# EAGLE design labwiz-board (EAGLE 6.5.0)
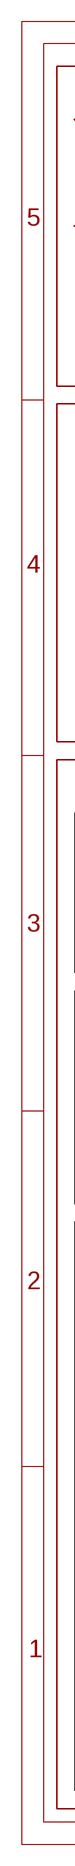
[diagram p0: schematic, sheet 1, part 1 of 2]
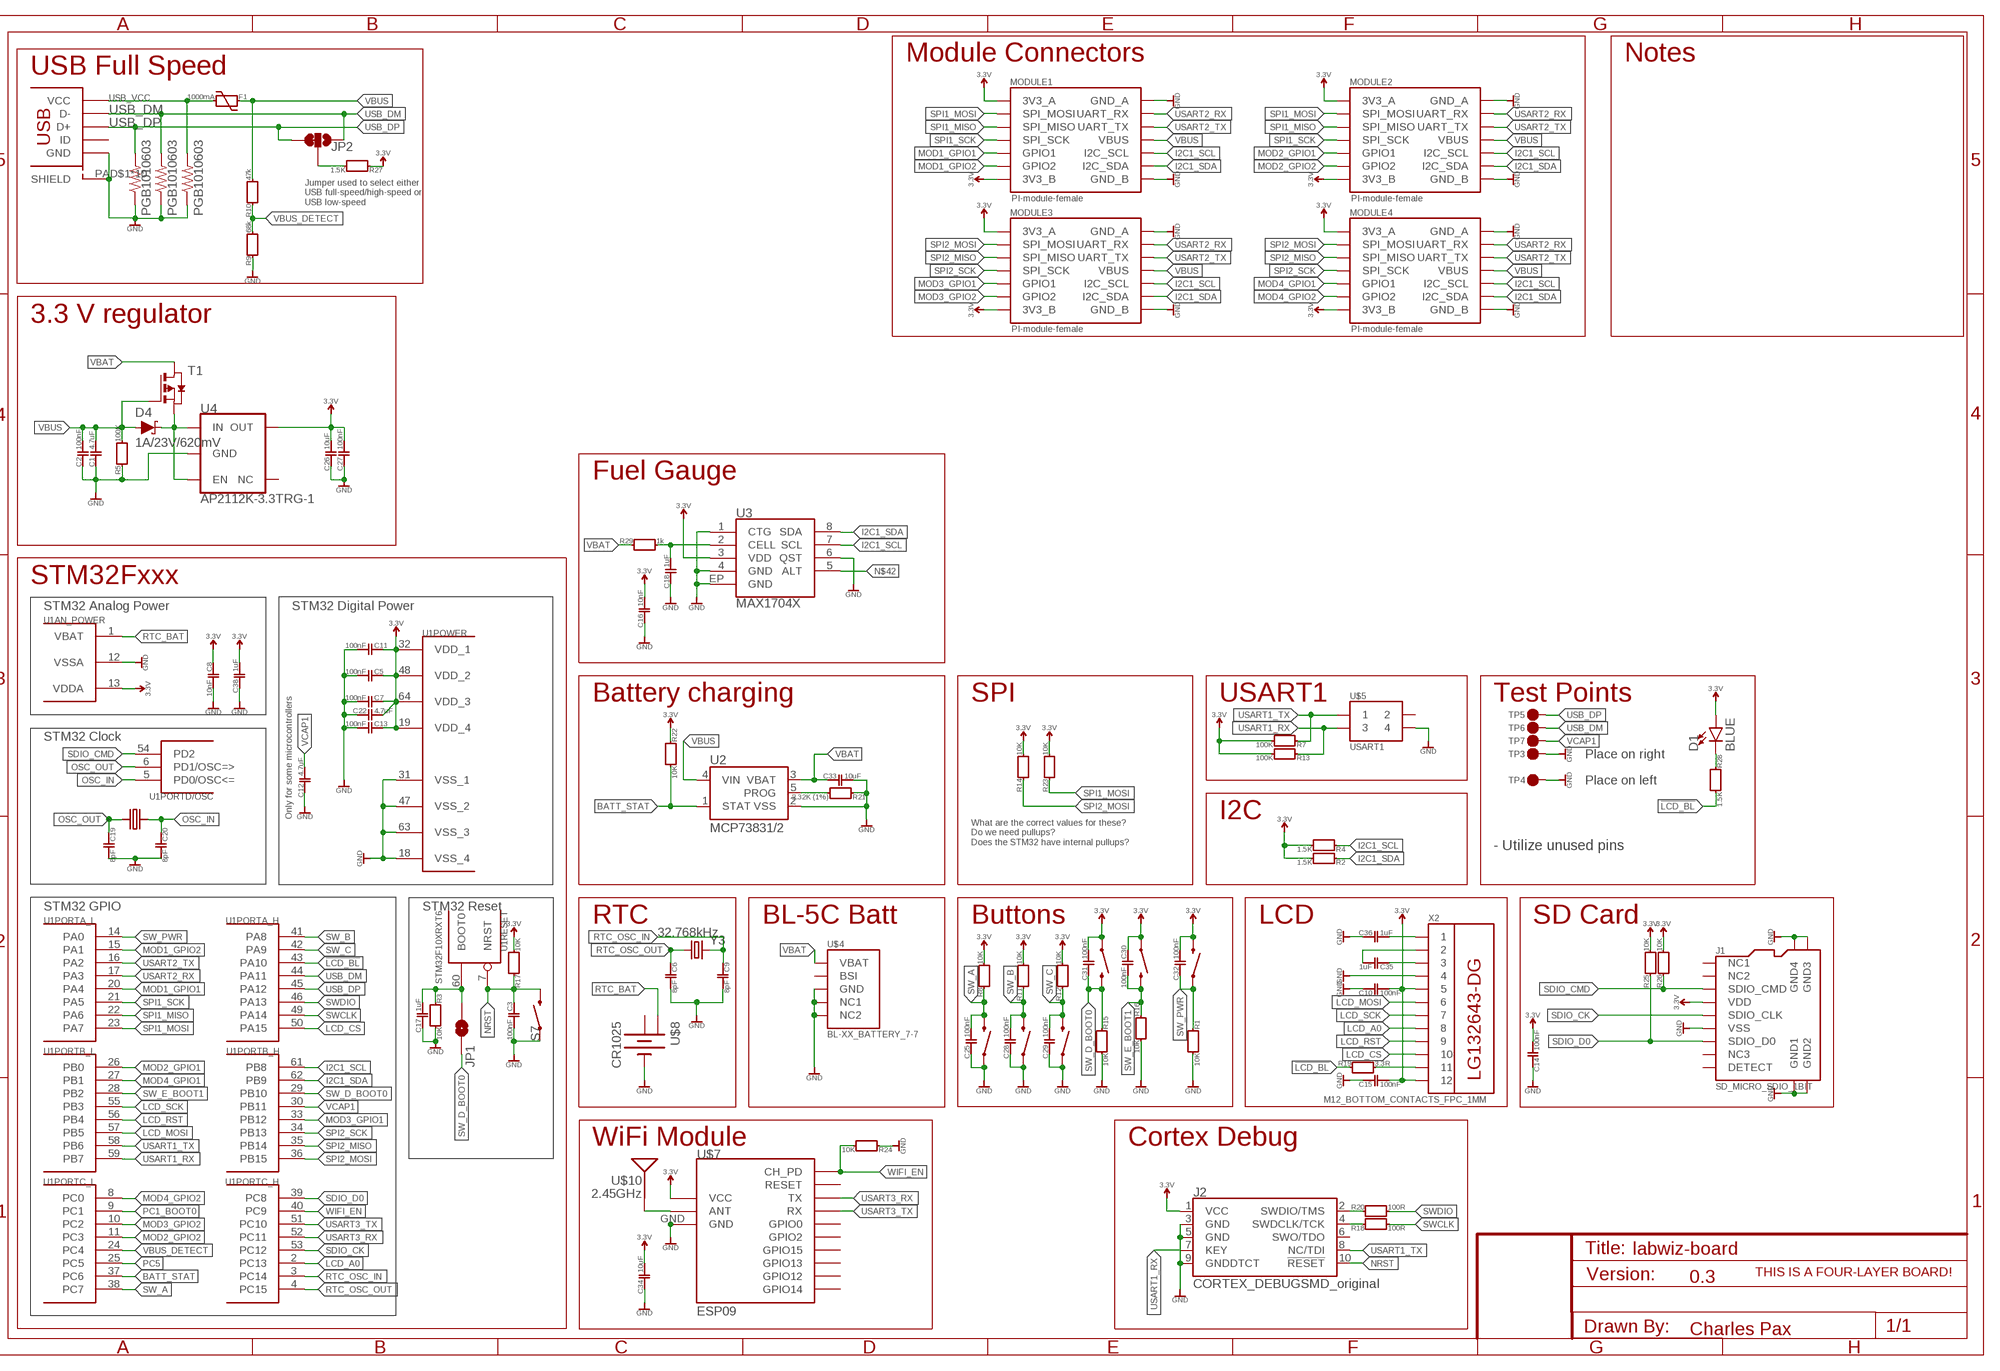
[diagram p1: schematic, sheet 1, part 2 of 2]

## Parts
C1  4.7uF  CAPACITOR_FIXED_4.7UF_0402  [0402]
C2  100nF  CAPACITOR_FIXED_100NF_0402  [0402]
C3  100nF  CAPACITOR_FIXED_100NF_0402  [0402]
C5  100nF  CAPACITOR_FIXED_100NF_0402  [0402]
C6  8pF  CAPACITOR_FIXED_8PF_0402  [0402]
C7  100nF  CAPACITOR_FIXED_100NF_0402  [0402]
C8  10nF  CAPACITOR_FIXED_10NF_0402  [0402]
C9  8pF  CAPACITOR_FIXED_8PF_0402  [0402]
C10  100nF  CAPACITOR_FIXED_100NF_0402  [0402]
C11  100nF  CAPACITOR_FIXED_100NF_0402  [0402]
C12  4.7uF  CAPACITOR_FIXED_4.7UF_0402  [0402]
C13  100nF  CAPACITOR_FIXED_100NF_0402  [0402]
C14  100nF  CAPACITOR_FIXED_100NF_0402  [0402]
C15  100nF  CAPACITOR_FIXED_100NF_0402  [0402]
C16  10nF  CAPACITOR_FIXED_10NF_0402  [0402]
C17  1uF  CAPACITOR_FIXED_1UF_0402  [0402]
C18  1uF  CAPACITOR_FIXED_1UF_0402  [0402]
C19  8pF  CAPACITOR_FIXED_8PF_0402  [0402]
C20  8pF  CAPACITOR_FIXED_8PF_0402  [0402]
C22  4.7uF  CAPACITOR_FIXED_4.7UF_0402  [0402]
C25  100nF  CAPACITOR_FIXED_100NF_0402  [0402]
C26  10uF  CAPACITOR_FIXED_10UF_0402  [0402]
C27  100nF  CAPACITOR_FIXED_100NF_0402  [0402]
C28  100nF  CAPACITOR_FIXED_100NF_0402  [0402]
C29  100nF  CAPACITOR_FIXED_100NF_0402  [0402]
C30  100nF  CAPACITOR_FIXED_100NF_0402  [0402]
C31  100nF  CAPACITOR_FIXED_100NF_0402  [0402]
C32  100nF  CAPACITOR_FIXED_100NF_0402  [0402]
C33  10uF  CAPACITOR_FIXED_10UF_0402  [0402]
C34  10uF  CAPACITOR_FIXED_10UF_0402  [0402]
C35  1uF  CAPACITOR_FIXED_1UF_0402  [0402]
C36  1uF  CAPACITOR_FIXED_1UF_0402  [0402]
C38  1uF  CAPACITOR_FIXED_1UF_0402  [0402]
D1  BLUE  LED-BLUE0603  [LED-0603]
D4  1A/23V/620mV  DIODE-SCHOTTKY-BAT20J  [SOD-323]
F1  1000mA  FUSE_RESETTABLE_PTC_1000MA_0805  [0805]
J1  SD_MICRO_SDIO_1BIT  [SD_MICRO_1]
J2  CORTEX_DEBUGSMD_original  CORTEX_DEBUG_SMD  [SAMTECH_FTSH-105-01]
JP1  DNP  JUMPER-PAD-2-NOYES_SILK  [PAD-JUMPER-2-NO_YES_SILK]
JP2  JUMPER-SMT_3_1-NC_TRACE_SILK  [SMT-JUMPER_3_1-NC_TRACE_SILK]
MODULE1  PI-module-female  PAX_MODULE_EDGE_FEMALE_HOST  [M07X2_2MM_EDGE]
MODULE2  PI-module-female  PAX_MODULE_EDGE_FEMALE_HOST  [M07X2_2MM_EDGE]
MODULE3  PI-module-female  PAX_MODULE_EDGE_FEMALE_HOST  [M07X2_2MM_EDGE]
MODULE4  PI-module-female  PAX_MODULE_EDGE_FEMALE_HOST  [M07X2_2MM_EDGE]
R1  10K  RESISTOR_FIXED_10K_0402  [0402]
R2  1.5K  RESISTOR_FIXED_1.5K_0402  [0402]
R3  10K  RESISTOR_FIXED_10K_0402  [0402]
R4  1.5K  RESISTOR_FIXED_1.5K_0402  [0402]
R5  100K  RESISTOR_FIXED_100K_0402  [0402]
R7  100K  RESISTOR_FIXED_100K_0402  [0402]
R8  10K  RESISTOR_FIXED_10K_0402  [0402]
R9  68k  RESISTOR_FIXED_0402  [0402]
R10  47k  RESISTOR_FIXED_0402  [0402]
R11  10K  RESISTOR_FIXED_10K_0402  [0402]
R12  10K  RESISTOR_FIXED_10K_0402  [0402]
R13  100K  RESISTOR_FIXED_100K_0402  [0402]
R14  10K  RESISTOR_FIXED_10K_0402  [0402]
R15  10K  RESISTOR_FIXED_10K_0402  [0402]
R16  10K  RESISTOR_FIXED_10K_0402  [0402]
R17  10K  RESISTOR_FIXED_10K_0402  [0402]
R18  100R  RESISTOR_FIXED_100R_0402  [0402]
R19  3.3R  RESISTOR_FIXED_3.3R_0402  [0402]
R20  100R  RESISTOR_FIXED_100R_0402  [0402]
R21  2.32K (1%)  RESISTOR_FIXED_2.32K_0402  [0402]
R22  10K  RESISTOR_FIXED_10K_0402  [0402]
R23  10K  RESISTOR_FIXED_10K_0402  [0402]
R24  10K  RESISTOR_FIXED_10K_0402  [0402]
R25  10K  RESISTOR_FIXED_10K_0402  [0402]
R26  10K  RESISTOR_FIXED_10K_0402  [0402]
R27  1.5K  RESISTOR_FIXED_1.5K_0402  [0402]
R28  1.5K  RESISTOR_FIXED_1.5K_0402  [0402]
R29  1k  RESISTOR_FIXED_0402  [0402]
S1  SWITCH-MOMENTARY-2SMD  [TACTILE_SWITCH_SMD]
S2  SWITCH-MOMENTARY-2SMD  [TACTILE_SWITCH_SMD]
S3  SWITCH-MOMENTARY-2SMD  [TACTILE_SWITCH_SMD]
S4  SWITCH-MOMENTARY-2SMD  [TACTILE_SWITCH_SMD]
S5  SWITCH-MOMENTARY-2SMD  [TACTILE_SWITCH_SMD]
S6  SWITCH-MOMENTARY-2SMD  [TACTILE_SWITCH_SMD]
S7  SWITCH-MOMENTARY-2SMD-3  [TACTILE_SWITCH_SMD-3]
T1  PMOSSOT23-6  [SOT23-6]
TP3  DNP  M01_TH  [M01_TH]
TP4  DNP  M01_TH  [M01_TH]
TP5  DNP  M01_PAD_1MM  [PAD_1MM]
TP6  DNP  M01_PAD_1MM  [PAD_1MM]
TP7  DNP  M01_PAD_1MM  [PAD_1MM]
U1  STM32F10XRXT6  [TQFP64]
U2  MCP73831/2  [SOT23-5]
U3  MAX1704X  [TDFN-8]
U4  AP2112K-3.3TRG-1  V_REG_AP2112K-3.3V  [SOT23-5]
U$1  USB_MICROSMT+THRUHULE  [USB_MICRO_THRUHOLE]
U$2  DNP  FOUR_LAYER_WARNING  [FOUR_LAYER_WARNING]
U$3  LG132643-DG  [LG132643-DG]
U$4  BL-XX_BATTERY_7-7  [BL-XX-BATTERY]
U$5  USART1  M02X2_RIGHT_ANGLE  [M02X2_TH_RIGHT_ANGLE]
U$7  ESP09  [ESP09]
U$8  CR1025  [CR2025]
U$9  8MHz  NX3225GD  [NX3225GD]
U$10  2.45GHz  ANTENNA2.4GHZ-6.5X2.2MM  [ANT-2.4GHZ-6.5X2.2MM]
X2  M12_BOTTOM_CONTACTS_FPC_1MM  [FPC_12P_1MM]
Y3  32.768kHz  CRYSTAL3.2X1.5MM  [CRYSTAL-SMD-3.2X1.5MM]
Z1  PGB1010603  SPARKFUN-RESISTORS_RESISTOR0603-RES  [SPARKFUN-RESISTORS_0603-RES]
Z2  PGB1010603  SPARKFUN-RESISTORS_RESISTOR0603-RES  [SPARKFUN-RESISTORS_0603-RES]
Z3  PGB1010603  SPARKFUN-RESISTORS_RESISTOR0603-RES  [SPARKFUN-RESISTORS_0603-RES]

## Nets
3.3V: C5.1 C7.1 C8.1 C10.2 C11.1 C13.1 C14.2 C15.2 C16.2 C22.2 C26.2 C27.2 C30.1 C31.2 C32.2 C34.2 C38.2 D1.A J1.4(VDD) J2.1(VCC) MODULE1.P$1(3V3_A) MODULE1.P$13(3V3_B) MODULE2.P$1(3V3_A) MODULE2.P$13(3V3_B) MODULE3.P$1(3V3_A) MODULE3.P$13(3V3_B) MODULE4.P$1(3V3_A) MODULE4.P$13(3V3_B) R2.1 R4.1 R7.1 R8.1 R11.1 R12.1 R13.1 R14.1 R17.1 R22.2 R23.1 R25.1 R26.1 R27.2 S4.1 S5.1 S6.3 U1.13(AN_POWER:VDDA) U1.19(POWER:VDD_4) U1.32(POWER:VDD_1) U1.48(POWER:VDD_2) U1.64(POWER:VDD_3) U3.3(VDD) U4.5(OUT) U$7.VCC X2.5 X2.12
!LCD_BL: R19.2 R28.1 U1.43(PORTA_H:PA10)
BATT_STAT: R22.1 U1.37(PORTC_L:PC6) U2.1(STAT)
GND [GND]: C1.1 C2.1 C3.2 C5.2 C6.2 C7.2 C8.2 C9.2 C10.1 C11.2 C12.1 C13.2 C14.1 C15.1 C16.1 C17.1 C18.1 C19.2 C20.2 C22.1 C25.1 C26.1 C27.1 C28.1 C29.1 C33.2 C34.1 C36.1 C38.1 J1.6(VSS) J1.G1(GND1) J1.G2(GND2) J1.G3(GND3) J1.G4(GND4) J2.3(GND) J2.5(GND) J2.9(GNDDTCT) MODULE1.P$2(GND_A) MODULE1.P$14(GND_B) MODULE2.P$2(GND_A) MODULE2.P$14(GND_B) MODULE3.P$2(GND_A) MODULE3.P$14(GND_B) MODULE4.P$2(GND_A) MODULE4.P$14(GND_B) R1.1 R3.1 R5.2 R9.2 R15.1 R16.1 R21.2 R24.2 S1.1 S2.1 S3.1 S7.1 TP3.P$1 TP4.P$1 U1.12(AN_POWER:VSSA) U1.18(POWER:VSS_4) U1.31(POWER:VSS_1) U1.47(POWER:VSS_2) U1.63(POWER:VSS_3) U2.2(VSS) U3.1(CTG) U3.4(GND) U3.6(QST) U3.EP(GND) U4.2(GND) U$1.PAD$1(SHIELD) U$1.PAD$2(SHIELD) U$1.PAD$3(SHIELD) U$1.PAD$4(SHIELD) U$1.PAD$5(SHIELD) U$1.PAD$6(SHIELD) U$1.PAD$7(SHIELD) U$1.PAD$8(SHIELD) U$1.PAD$9(SHIELD) U$1.PAD$10(SHIELD) U$1.PIN$5(GND) U$4.P$3(GND) U$4.P$4(NC1) U$4.P$5(NC2) U$5.4 U$7.GND U$7.GND1 U$7.GND2 U$7.GND3 U$7.GND4 U$7.GND5 U$7.GND6 U$7.GND7 U$8.P$1(-) X2.4 Z1.1 Z2.1 Z3.1
I2C1_SCL: MODULE1.P$10(I2C_SCL) MODULE2.P$10(I2C_SCL) MODULE3.P$10(I2C_SCL) MODULE4.P$10(I2C_SCL) R4.2 U1.61(PORTB_H:PB8) U3.7(SCL)
I2C1_SDA [3.3V power]: MODULE1.P$12(I2C_SDA) MODULE2.P$12(I2C_SDA) MODULE3.P$12(I2C_SDA) MODULE4.P$12(I2C_SDA) R2.2 U1.62(PORTB_H:PB9) U3.8(SDA)
LCD_A0: U1.2(PORTC_H:PC13) X2.8
LCD_CS: U1.50(PORTA_H:PA15) X2.10
LCD_MOSI: U1.57(PORTB_L:PB5) X2.6
LCD_RST: U1.56(PORTB_L:PB4) X2.9
LCD_SCK: U1.55(PORTB_L:PB3) X2.7
MOD1_GPIO1: MODULE1.P$9(GPIO1) U1.20(PORTA_L:PA4)
MOD1_GPIO2: MODULE1.P$11(GPIO2) U1.15(PORTA_L:PA1)
MOD2_GPIO1: MODULE2.P$9(GPIO1) U1.26(PORTB_L:PB0)
MOD2_GPIO2: MODULE2.P$11(GPIO2) U1.11(PORTC_L:PC3)
MOD3_GPIO1: MODULE3.P$9(GPIO1) U1.33(PORTB_H:PB12)
MOD3_GPIO2: MODULE3.P$11(GPIO2) U1.10(PORTC_L:PC2)
MOD4_GPIO1: MODULE4.P$9(GPIO1) U1.27(PORTB_L:PB1)
MOD4_GPIO2: MODULE4.P$11(GPIO2) U1.8(PORTC_L:PC0)
N$4: R19.1 X2.11
N$5: JP2.2 R27.1
N$13: U$7.ANT U$10.FEED(SIGNAL)
N$16: C18.2 R29.1 U3.2(CELL)
N$25: D1.C R28.2
N$26 [3.3V power]: D4.C T1.4(S) U4.1(IN) U4.3(EN)
N$37: C35.1 X2.3
N$38: C35.2 X2.2
N$39: C36.2 X2.1
N$42: U3.5(ALT)
N$70: R21.1 U2.5(PROG)
NRST: C3.1 J2.10(!RESET) R17.2 S7.4 U1.7(RESET:NRST)
OSC_IN: C20.1 U1.5(PORTD/OSC:PD0/OSC<=) U$9.P$2
OSC_OUT: C19.1 U1.6(PORTD/OSC:PD1/OSC=>) U$9.P$1
PC1_BOOT0: C17.2 JP1.2 R3.2 U1.9(PORTC_L:PC1) U1.60(RESET:BOOT0)
PC5: U1.25(PORTC_L:PC5)
RTC_BAT [RTC battery]: U1.1(AN_POWER:VBAT) U$8.P$3(+1)
RTC_OSC_IN: C9.1 U1.3(PORTC_H:PC14) Y3.P$2
RTC_OSC_OUT: C6.1 U1.4(PORTC_H:PC15) Y3.P$1
SDIO_CK: J1.5(SDIO_CLK) U1.53(PORTC_H:PC12)
SDIO_CMD: J1.3(SDIO_CMD) R26.2 U1.54(PORTD/OSC:PD2)
SDIO_D0: J1.7(SDIO_D0) R25.2 U1.39(PORTC_H:PC8)
SPI1_MISO: MODULE1.P$5(SPI_MISO) MODULE2.P$5(SPI_MISO) U1.22(PORTA_L:PA6)
SPI1_MOSI: MODULE1.P$3(SPI_MOSI) MODULE2.P$3(SPI_MOSI) R23.2 U1.23(PORTA_L:PA7)
SPI1_SCK: MODULE1.P$7(SPI_SCK) MODULE2.P$7(SPI_SCK) U1.21(PORTA_L:PA5)
SPI2_MISO: MODULE3.P$5(SPI_MISO) MODULE4.P$5(SPI_MISO) U1.35(PORTB_H:PB14)
SPI2_MOSI: MODULE3.P$3(SPI_MOSI) MODULE4.P$3(SPI_MOSI) R14.2 U1.36(PORTB_H:PB15)
SPI2_SCK: MODULE3.P$7(SPI_SCK) MODULE4.P$7(SPI_SCK) U1.34(PORTB_H:PB13)
SW_A: C25.2 R8.2 S3.3 U1.38(PORTC_L:PC7)
SW_B: C28.2 R11.2 S2.3 U1.41(PORTA_H:PA8)
SW_C: C29.2 R12.2 S1.3 U1.42(PORTA_H:PA9)
SW_D_BOOT0: C31.1 JP1.1 R15.2 S4.3 U1.29(PORTB_H:PB10)
SW_E_BOOT1: C30.2 R16.2 S5.3 U1.28(PORTB_L:PB2)
SW_PWR: C32.1 R1.2 S6.1 U1.14(PORTA_L:PA0)
SWCLK: R18.1 U1.49(PORTA_H:PA14)
SWDCLK_M: J2.4(SWDCLK/TCK) R18.2
SWDIO: R20.1 U1.46(PORTA_H:PA13)
SWDIO_M: J2.2(SWDIO/TMS) R20.2
USART1_RX: J2.7(KEY) R13.2 U1.59(PORTB_L:PB7) U$5.3
USART1_TX: J2.8(NC/TDI) R7.2 U1.58(PORTB_L:PB6) U$5.1
USART2_RX: MODULE1.P$4(UART_RX) MODULE2.P$4(UART_RX) MODULE3.P$4(UART_RX) MODULE4.P$4(UART_RX) U1.17(PORTA_L:PA3)
USART2_TX: MODULE1.P$6(UART_TX) MODULE2.P$6(UART_TX) MODULE3.P$6(UART_TX) MODULE4.P$6(UART_TX) U1.16(PORTA_L:PA2)
USART3_RX: U1.52(PORTC_H:PC11) U$7.TX
USART3_TX: U1.51(PORTC_H:PC10) U$7.RX
USB_DM: JP2.1 TP6.P$1 U1.44(PORTA_H:PA11) U$1.PIN$2(D-) Z2.2
USB_DP: JP2.3 TP5.P$1 U1.45(PORTA_H:PA12) U$1.PIN$3(D+) Z1.2
USB_VCC: F1.1 U$1.PIN$1(VCC) Z3.2
VBAT: C33.1 R29.2 T1.1(D) T1.2(D) T1.5(D) T1.6(D) U2.3(VBAT) U$4.P$1(VBAT)
VBUS [3.3V power]: C1.2 C2.2 D4.A F1.2 MODULE1.P$8(VBUS) MODULE2.P$8(VBUS) MODULE3.P$8(VBUS) MODULE4.P$8(VBUS) R5.1 R10.1 T1.3(G) U2.4(VIN)
VBUS_DETECT: R9.1 R10.2 U1.24(PORTC_L:PC4)
VCAP1: C12.2 TP7.P$1 U1.30(PORTB_H:PB11)
WIFI_EN: R24.1 U1.40(PORTC_H:PC9) U$7.CH_PD
Unconnected: J1.1(NC1) J1.2(NC2) J1.8(NC3) J1.9(DETECT) J2.6(SWO/TDO) U4.4(NC) U$1.PIN$4(ID) U$4.P$2(BSI) U$5.2 U$7.GPIO0 U$7.GPIO02(GPIO2) U$7.GPIO12 U$7.GPIO13 U$7.GPIO14 U$7.GPIO15 U$7.RESET

## Notes on the sheet
- Module Connectors | Notes
- USB Full Speed
- Jumper used to select either
  USB full-speed/high-speed or
  USB low-speed
- 3.3 V regulator
- Fuel Gauge
- STM32Fxxx
- STM32 Analog Power | STM32 Digital Power
- Battery charging | SPI | USART1 | Test Points
- STM32 Clock
- Place on right
- Place on left
- Only for some microcontrollers
- What are the correct values for these?
  Do we need pullups?
  Does the STM32 have internal pullups?
- I2C
- - Utilize unused pins
- STM32 GPIO | STM32 Reset
- RTC | BL-5C Batt | Buttons | LCD | SD Card
- WiFi Module | Cortex Debug
- 0.3
- Charles Pax

## Power pins joined to a net without a drawn wire
+: U$8.P$2(+)

## Library data of the parts
C1-C3 C5-C20 C22 C25-C36 C38 = PaxInstruments-RCL:CAPACITOR_FIXED: Capacitor
D1 = SparkFun-LED:LED-BLUE: Blue SMD LED Used in manufacturing of various products at SparkFun Packages: 0603 - SMD 0603 package [Product Link] <http://www.digikey.com/product-detail/en/SMLE12BC7TT86/511-1589-2-ND/1641808> 1206 - SMD1206 package [Product Link] <http://www.digikey.com/product-detail/en/lite-on-inc/LTST-C150TBKT/160-1643-1-ND/573584> SparkFun Products: ESP8266 Thing-Dev Board <https://www.sparkfun.com/products/13711> RedBoard <https://www.sparkfun.com/products/12757>; PROD_ID: DIO-08575
D4 = SparkFun-DiscreteSemi:DIODE-SCHOTTKY: Schottky diode A Schottky diode is a semiconductor diode which has a low forward voltage drop and a very fast switching action.; PROD_ID: DIO-11623
F1 = PaxInstruments-RCL:FUSE_RESETTABLE_PTC
J1 = PaxInstruments-Connectors:SD_MICRO_SDIO_1BIT
J2 = PaxInstruments-Connectors:CORTEX_DEBUG: Cortex Debug Connector - 10 pin Supports JTAG debug, Serial Wire debug, and Serial Wire Viewer. PTH and SMD connector options available. General Connector Information <http://infocenter.arm.com/help/topic/com.arm.doc.faqs/attached/13634/cortex_debug_connectors.pdf> Products: PTH Connector <http://www.digikey.com/product-detail/en/cnc-tech/3220-10-0100-00/1175-1627-ND/3883661> -via Digi-Key SparkFun PSoc <https://www.sparkfun.com/products/13229> SparkFun T <https://www.sparkfun.com/products/13810>
JP1 = SparkFun-Passives:JUMPER-PAD-2-NO
JP2 = SparkFun-Jumpers:JUMPER-SMT_3_1-NC_TRACE: Normally closed trace jumper (1 of 2 connections) This jumper has a trace between two pads so it's normally closed (NC). The other connection is normally open (NO). Use a razor knife to open the connection. For best results follow the IPC guidelines for cutting traces: Cutout at least 0.063 mm (0.005 in). Remove all loose material to clean up the cut area. Seal the cut with an approved epoxy. Reapply solder to reclose the connection, or to close the NO connection.
MODULE1-MODULE4 = PaxInstruments-Connectors:PAX_MODULE; MF: Pax Instruments; MPN: PIxxxx
R1-R5 R7-R20 R22-R29 = PaxInstruments-RCL:RESISTOR_FIXED: Resistor
R21 = PaxInstruments-RCL:RESISTOR_FIXED: Resistor; VALUE: 2.32K
S1-S6 = SparkFun-Electromechanical:SWITCH-MOMENTARY-2: Various NO switches- pushbuttons, reed, etc; MF: C&K Components; MPN: RS-187R05A2-DS MT RT
S7 = PaxInstruments-Electromechanical:SWITCH-MOMENTARY-2: Various NO switches- pushbuttons, reed, etc
T1 = zetex:PMOSSOT23-6: P-CHANNEL ENHANCEMENT MODE MOSFET Source: Data sheet <http://www.diodes.com/zetex/_pdfs/3.0/pdf/ZXMP10A17E6.pdf> ZXMP10A17E6; OC_FARNELL: unknown; OC_NEWARK: unknown
TP3-TP7 = PaxInstruments-Connectors:M01: Single contact
U1 = stm32:STM32F10XRXT6: STM32F101/103 64pin LQFP
U2 = PaxInstruments-PowerIC:MCP73831/2: Miniature single cell, fully integrated Li-Ion, Li-polymer charge management controller http://ww1.microchip.com/downloads/en/DeviceDoc/21984a.pdf IC-09995; MF: Microchip Technology; MPN: MCP73832T-2DCI/OT
U3 = SparkFun-IC-Power:MAX1704X: MAX17043/MAX17044: Battery Fuel Guage (43 is 1cell, 44 is 2cell); PROD-ID: IC-10399
U4 = PaxInstruments-PowerIC:V_REG_AP2112: AP2112 - 600mA CMOS LDO Regulator w/ Enable The AP2112 is CMOS process low dropout linear regulator with enable function, the regulator delivers a guaranteed 600mA (min.) continuous load current. Features Output Voltage Accuracy: ±1.5% Output Current: 600mA (Min.) Foldback Short Current Protection: 50mA Enable Function to Turn ON/OFF VOUT Low Dropout Voltage (3.3V): 250mV (Typ.) @IOUT=600mA Excellent Load Regulation: 0.2%/A (Typ.) Excellent Line Regulation: 0.02%/V (Typ.) Low Quiescent Current: 55μA (Typ.) Low Standby Current: 0.01μA (Typ.) Low Output Noise: 50μVRMS PSRR: 100Hz -65dB, 1kHz -65dB OTSD Protection Stable with 1.0μF Flexible Cap: Ceramic, Tantalum and Aluminum Electrolytic Operation Temperature Range: -40°C to 85°C ESD: MM 400V, HBM 4000V; PROD_ID: VREG-12457; VALUE: 3.3V
U$1 = blinkinlabs:USB_MICRO; MF: FCI; MPN: 10118194-0001LF
U$2 = SparkFun-Aesthetics:FOUR_LAYER_WARNING: Four-Layer Board Warning - tDoc Layer Warning text which will appear on both the schematic and the board file, notifying viewers that the design is a four-layer PCB.
U$3 = PaxInstruments-Displays:LG132643-DG; MF: Pax Instruments; MPN: LG132643-DW
U$4 = PaxInstruments-Connectors:BL-XX_BATTERY: Battery connector. Used with BL-4C, BL-5C, and similar three terminal batteries.; MPN: BC-4-3P (77H)
U$5 = PaxInstruments-Connectors:M02X2
U$7 = PaxInstruments-DigitalIC:ESP09: ESP8266 Wifi module 09
U$8 = PaxInstruments-Electromechanical:CR1025
U$9 = PaxInstruments-FreqCtrl:NX3225GD
U$10 = SparkFun-RF:ANTENNA: Single-ended Antennae 2.4GHz and antennae with just one terminal. These are all chip antennae. 2.4GHz (WiFi/BT/ZigBee) Antennae ANT-2.4GHZ-6.5X2.2MM - 6.5 x 2.2 mm chip antenna. (SparkFun Product <https://www.sparkfun.com/products/144>) ANT-2.4GHZ8.0X1.0MM - 8.0 x 1.0 mm chip antenna. (Datasheet <http://www.mouser.com/ds/2/611/antenna_2500at44m0400-242425.pdf>) ANT-2.4GHZ9.5X2.0MM - 9.5 x 2.0 mm chip antenna. (SparkFun Product <https://www.sparkfun.com/products/9025>); PROD_ID: ANT-08187; SF_ID: WRL-00144
X2 = PaxInstruments-Connectors:M12; MF: Hirose Connector; MPN: FH12-12S-1SH(55)
Y3 = SparkFun-FreqCtrl:CRYSTAL: Various standard crystals. Proven footprints.; PROD_ID: XTAL-13062
Z1-Z3 = PaxInstrument-T400:SPARKFUN-RESISTORS_RESISTOR: Resistor Basic schematic elements and footprints for 0603, 1206, and PTH resistors.; MF: Littelfuse; MPN: PGB1010603NRHF

## Net classes
0 Digital signal: width 0.1 mm, drill 0.2 mm, clearance 0.15 mm
1 3.3V power: width 0.1 mm, drill 0.2 mm, clearance 0.15 mm
2 RTC battery: width 0.1 mm, drill 0.2 mm, clearance 0.15 mm
3 5V power: width 0.1 mm, drill 0.2 mm, clearance 0.15 mm
4 Analog signal: width 0.1 mm, drill 0.2 mm, clearance 0.15 mm
5 GND: width 0.1 mm, drill 0.2 mm, clearance 0.15 mm

## Board
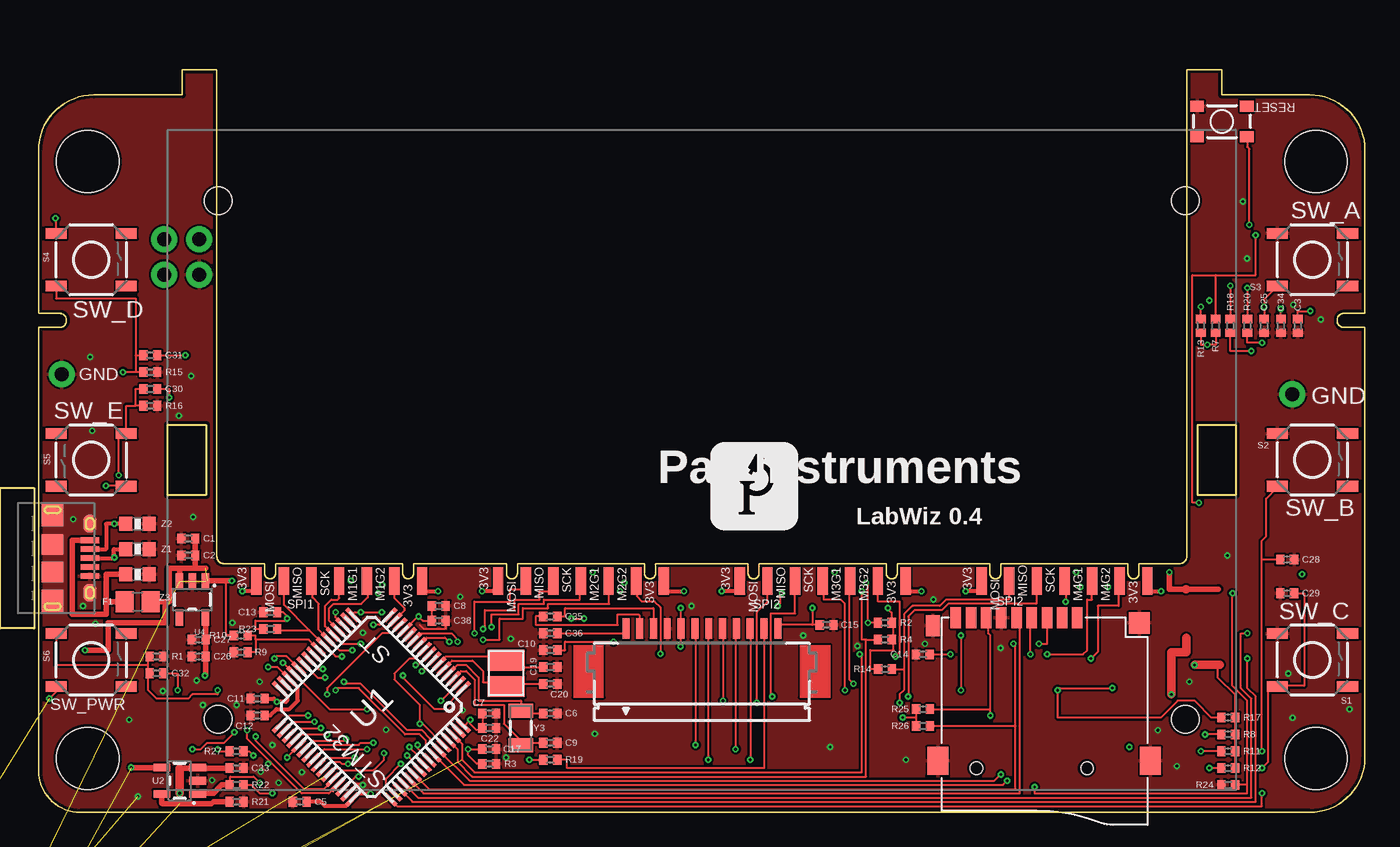
[diagram p2: board, top side]
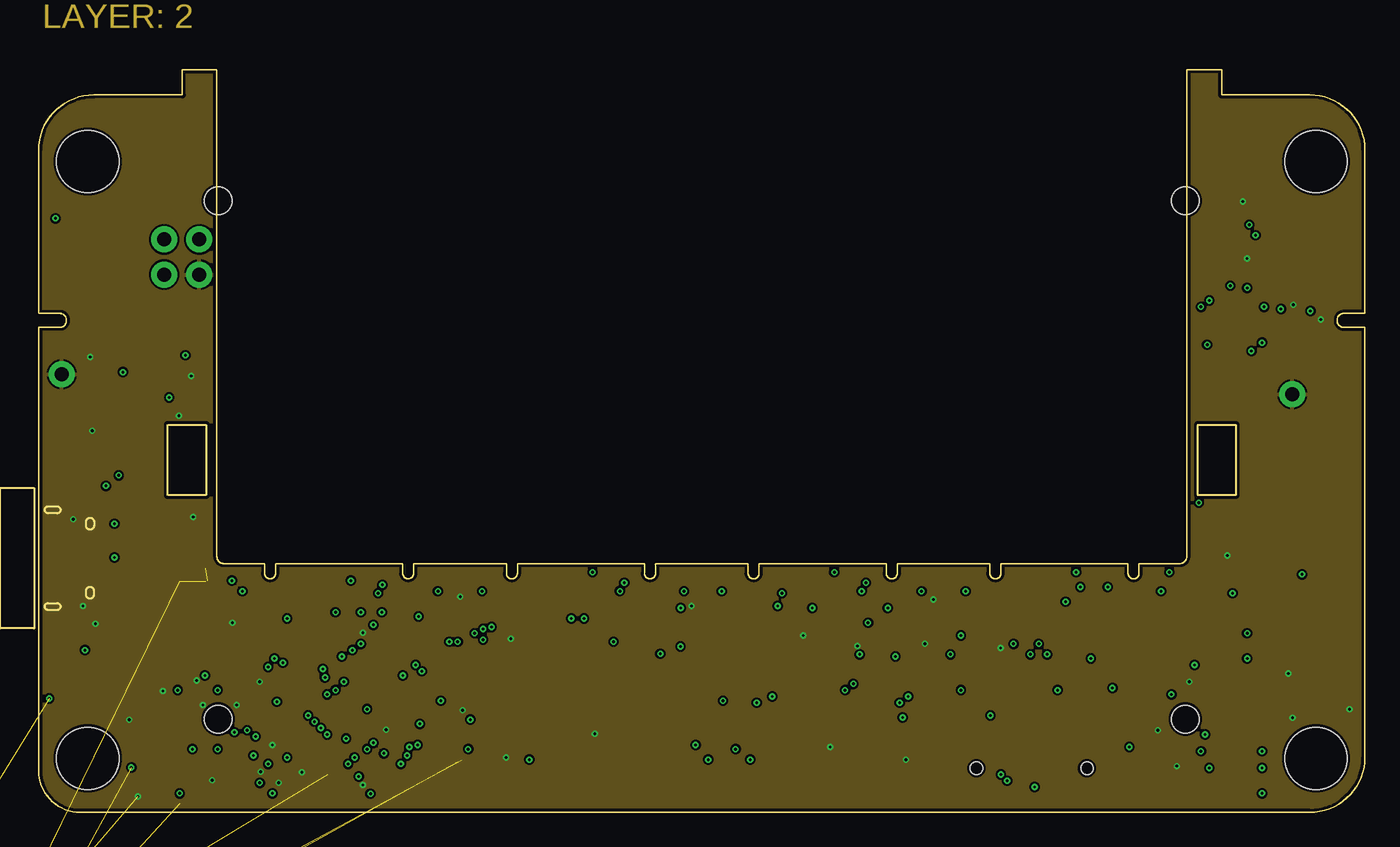
[diagram p3: board, inner layer GND]
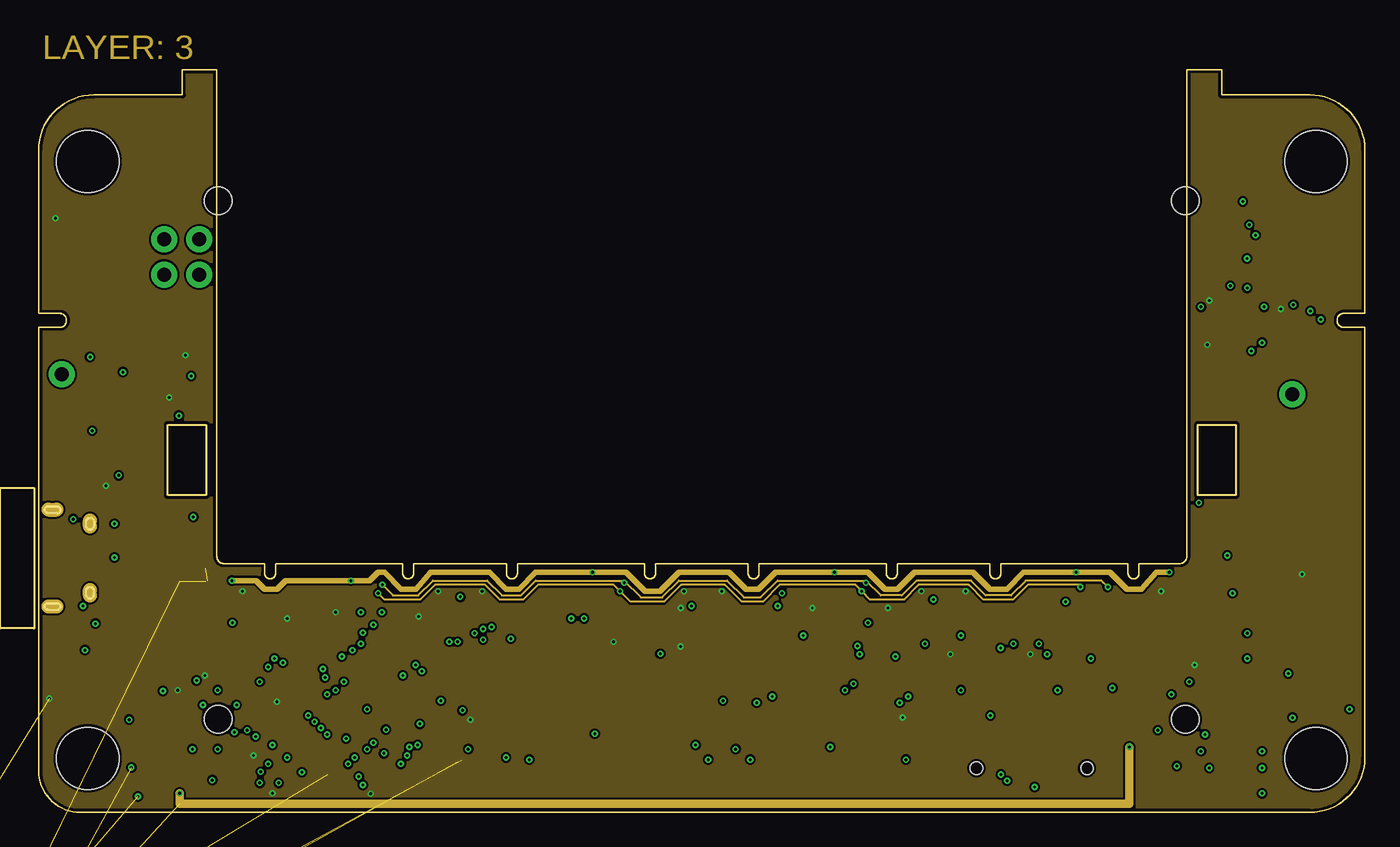
[diagram p4: board, inner layer 3.3V]
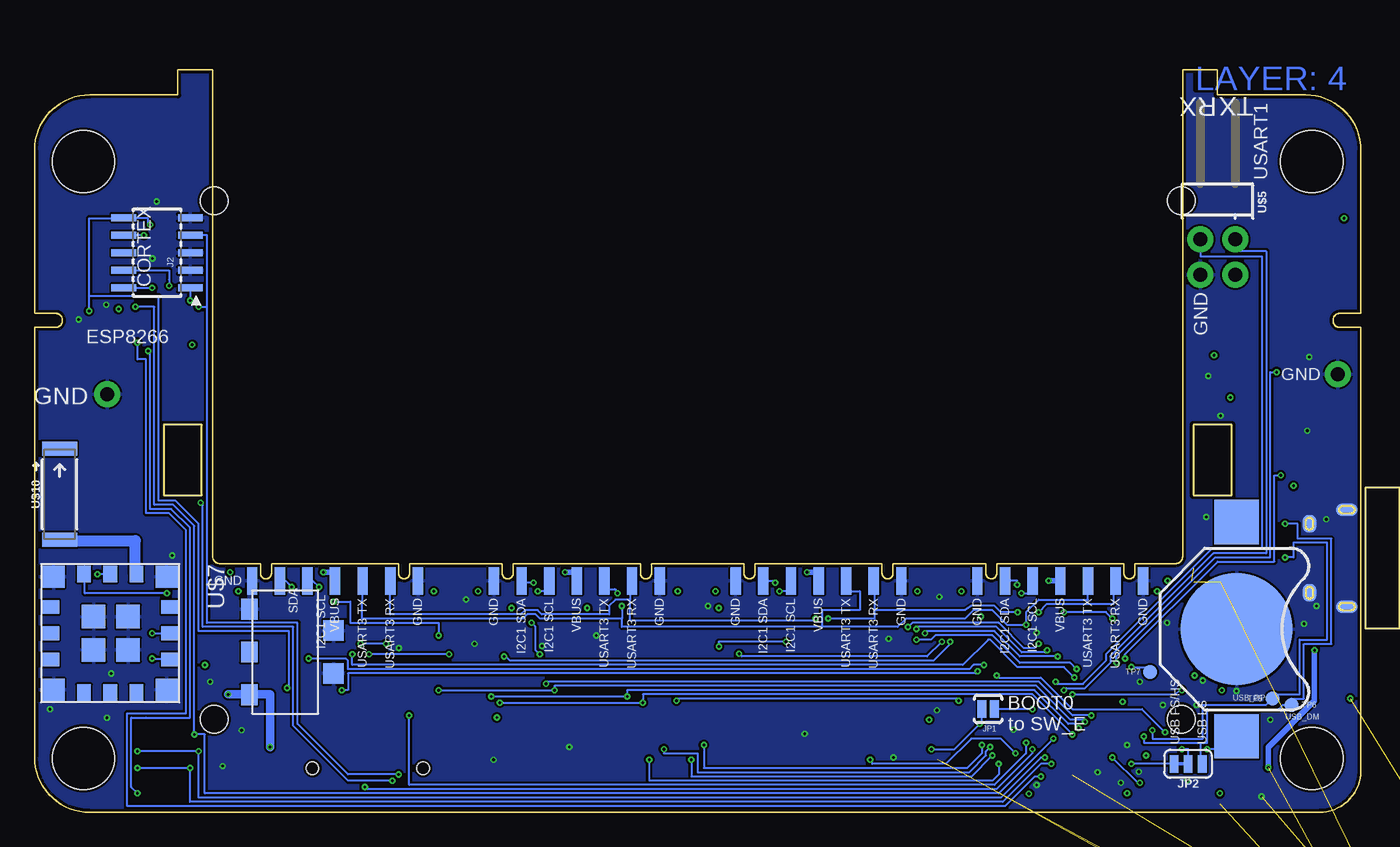
[diagram p5: board, bottom side, seen from below]

Size 96 x 53.74 mm. Coordinates in mm from the lower left corner, seen from the top.
Outline: 92,51.91 arc-90 96,47.91 96,36.1 94.4,36.1 arc90 94,35.6 arc90 94.4,35.1 96,35.1 96,4 arc-90 92,0 3,0 arc-90 0,3 0,35.1 1.6,35.1 arc90 2,35.6 arc90 1.6,36.1 0,36.1 0,47.91 arc-90 4,51.91 10.39,51.91 10.39,53.74 12.9,53.74 12.9,18.5 arc90 13.4,18 16.35,18 16.35,17.3 arc180 17.15,17.3 17.15,18 26.35,18 26.35,17.3 arc180 27.15,17.3 27.15,18 33.85,18 33.85,17.3 arc180 34.65,17.3 34.65,18 43.85,18 43.85,17.3 arc180 44.65,17.3 44.65,18 51.35,18 51.35,17.3 arc180 52.15,17.3 52.15,18 61.35,18 61.35,17.3 arc180 62.15,17.3 62.15,18 68.85,18 68.85,17.3 arc180 69.65,17.3 69.65,18 78.85,18 78.85,17.3 arc180 79.65,17.3 79.65,18 82.6,18 arc90 83.1,18.5 83.1,53.49
Outline: 83.11,18.5 83.11,53.74 85.62,53.74 85.62,51.91 92.01,51.91
Copper layers (1*2+15*16): Top 0.017mm / dielectric 0.5mm / GND 0.017mm / dielectric 0.075mm / 3.3V 0.017mm / dielectric 0.5mm / Bottom 0.017mm
Design rules "PaxInstrument-T400 *": minimum track width 0.1mm, minimum drill 0.2mm, track to track 0.075mm, track to pad 0.075mm, pad to pad 0.075mm, via to via 0.075mm, smd to smd 0.075mm, copper to edge 0.2mm, drill to drill 0.2mm, minimum pad ring 0.125mm, minimum via ring 0.125mm, stop-mask expansion 0mil, vias tented up to drill 0.45mm, thermal gap 0.15mm
Holes 4.5 mm at 92.45,3.91 92.45,47.09 3.55,47.09 3.55,3.91
tKeepout: area 0,0.4 to 7,7.4; area 0,43.6 to 7.1,50.6; area 89,43.6 to 96,50.6; area 89,0.4 to 96,7.4; 2 lines
vRestrict: area 15,1.4 to 81,52.2
Milling: 4 lines

### Footprints (pad centres in the part's own frame; a part is rotated, then mirrored left to right if it is on the bottom)
0402 = smd 0.6 x 0.7: 1 -0.5,0; 2 0.5,0
LED-0603 = smd 1 x 1: A -0.877,0; C 0.877,0
SOD-323 = smd 0.63 x 0.83: A 1.15,0; C -1.15,0
0805 = smd 1.3 x 1.5: 1 -0.95,0; 2 0.95,0
SD_MICRO_1 = smd 1.524 x 0.762: 1 -7.493,2.414; 2 -7.493,1.314; 3 -7.493,0.214; 4 -7.493,-0.886; 5 -7.493,-1.986; 6 -7.493,-3.086; 7 -7.493,-4.186; 8 -7.493,-5.286; 9 -7.493,-6.386 | smd 1.524 x 1.016: G1 -6.893,-8.032 | smd 2.032 x 1.524: G2 2.88,-7.686; G3 2.88,7.714 | smd 1.524 x 1.524: G4 -7.101,6.895 | hole 0.889: 3.407,-4.886; 3.407,3.114
SAMTECH_FTSH-105-01 = smd 0.508 x 1.778: 1 -2.54,-2.413; 2 -2.54,2.413; 3 -1.27,-2.413; 4 -1.27,2.413; 5 0,-2.413; 6 0,2.413; 7 1.27,-2.413; 8 1.27,2.413; 9 2.54,-2.413; 10 2.54,2.413
PAD-JUMPER-2-NO_YES_SILK = smd 0.635 x 1.27: 1 -0.45,0; 2 0.45,0
SMT-JUMPER_3_1-NC_TRACE_SILK = smd 0.635 x 1.27: 1 -1.016,0; 2 0,0; 3 1.016,0
M07X2_2MM_EDGE = smd 0.75 x 2: P$1 0,-0.25; P$3 2,-0.25; P$5 4,-0.25; P$7 6,-0.25; P$9 8,-0.25; P$11 10,-0.25; P$13 12,-0.25 | smd 0.75 x 2 bottom: P$2 0,-0.25; P$4 2,-0.25; P$6 4,-0.25; P$8 6,-0.25; P$10 8,-0.25; P$12 10,-0.25; P$14 12,-0.25
TACTILE_SWITCH_SMD = smd 1.524 x 0.762: 1 -2.54,1.905; 2 2.54,1.905; 3 -2.54,-1.905; 4 2.54,-1.905
TACTILE_SWITCH_SMD-3 = smd 1 x 0.8: 1 -1.8,1.1; 2 1.8,1.1; 3 -1.8,-1.1; 4 1.8,-1.1
SOT23-6 = smd 0.6 x 0.9: 1 -0.95,-1.15; 2 0,-1.15; 3 0.95,-1.15; 4 0.95,1.15; 5 0,1.15; 6 -0.95,1.15
M01_TH = drill 1.016 pad 1.88: P$1 0,0
PAD_1MM = smd 1 x 1: P$1 0,0
TQFP64 = smd 1.2 x 0.3: 1 -5.7,3.75; 2 -5.7,3.25; 3 -5.7,2.75; 4 -5.7,2.25; 5 -5.7,1.75; 6 -5.7,1.25; 7 -5.7,0.75; 8 -5.7,0.25; 9 -5.7,-0.25; 10 -5.7,-0.75; 11 -5.7,-1.25; 12 -5.7,-1.75; 13 -5.7,-2.25; 14 -5.7,-2.75; 15 -5.7,-3.25; 16 -5.7,-3.75; 33 5.7,-3.75; 34 5.7,-3.25; 35 5.7,-2.75; 36 5.7,-2.25; 37 5.7,-1.75; 38 5.7,-1.25; 39 5.7,-0.75; 40 5.7,-0.25; 41 5.7,0.25; 42 5.7,0.75; 43 5.7,1.25; 44 5.7,1.75; 45 5.7,2.25; 46 5.7,2.75; 47 5.7,3.25; 48 5.7,3.75 | smd 0.3 x 1.2: 17 -3.75,-5.7; 18 -3.25,-5.7; 19 -2.75,-5.7; 20 -2.25,-5.7; 21 -1.75,-5.7; 22 -1.25,-5.7; 23 -0.75,-5.7; 24 -0.25,-5.7; 25 0.25,-5.7; 26 0.75,-5.7; 27 1.25,-5.7; 28 1.75,-5.7; 29 2.25,-5.7; 30 2.75,-5.7; 31 3.25,-5.7; 32 3.75,-5.7; 49 3.75,5.7; 50 3.25,5.7; 51 2.75,5.7; 52 2.25,5.7; 53 1.75,5.7; 54 1.25,5.7; 55 0.75,5.7; 56 0.25,5.7; 57 -0.25,5.7; 58 -0.75,5.7; 59 -1.25,5.7; 60 -1.75,5.7; 61 -2.25,5.7; 62 -2.75,5.7; 63 -3.25,5.7; 64 -3.75,5.7
SOT23-5 = smd 0.55 x 1.2: 1 -0.95,-1.3; 2 0,-1.3; 3 0.95,-1.3; 4 0.95,1.3; 5 -0.95,1.3
TDFN-8 = smd 0.8 x 0.3: 1 -1.4,0.75; 2 -1.4,0.25; 3 -1.4,-0.25; 4 -1.4,-0.75; 5 1.4,-0.75; 6 1.4,-0.25; 7 1.4,0.25; 8 1.4,0.75 | smd 1.73 x 1.88: EP 0,0
USB_MICRO_THRUHOLE = smd 1.645 x 1.55: PAD$1 -3.123,0; PAD$4 3.123,0 | smd 1.5 x 1.55: PAD$2 -1,0; PAD$3 1,0 | smd 1.25 x 0.95: PAD$5 -2.5,2.7; PAD$6 2.5,2.7 | smd 0.9 x 1.55 bottom: PAD$7 -3.5,0; PAD$8 3.5,0 | smd 1.25 x 0.95 bottom: PAD$9 -2.5,2.7; PAD$10 2.5,2.7 | smd 0.4 x 1.35: PIN$1 -1.3,2.7; PIN$2 -0.65,2.7; PIN$3 0,2.7; PIN$4 0.65,2.7; PIN$5 1.3,2.7
LG132643-DG = hole 2: -35,-18.75; 35,-18.75; 35,18.75; -35,18.75
BL-XX-BATTERY = smd 1.5 x 1.2: P$1 3.1,-0.2; P$2 0,-0.2; P$3 -3.1,-0.2 | smd 1.5 x 1.5: P$4 1.55,5.9; P$5 -1.55,5.9
M02X2_TH_RIGHT_ANGLE = drill 1.016 pad 1.88: 1 0,-1.27; 2 -2.54,-1.27; 3 0,1.27; 4 -2.54,1.27
ESP09 = smd 1.2 x 1: ANT -4.3,1.9; CH_PD -4.3,-1.9; GPIO0 4.3,1.9; GPIO02 4.3,0; GPIO15 4.3,-1.9; VCC -4.3,0 | smd 1.6 x 1.6: GND -4.1,4.1; GND1 -4.1,-4.1; GND2 4.1,-4.1; GND3 4.1,4.1 | smd 1.7 x 1.7: GND4 1.2,1.3; GND5 -1.2,1.3; GND6 -1.2,-1.2; GND7 1.2,-1.2 | smd 1 x 1.2: GPIO12 0,-4.3; GPIO13 1.9,-4.3; GPIO14 -1.9,-4.3; RESET -1.9,4.3; RX 1.9,4.3; TX 0,4.3
CR2025 = smd 8.13 x 8.13: P$1 0,0 | smd 3.2 x 3.2: P$2 -7.75,0; P$3 7.75,0
NX3225GD = smd 1.5 x 2.7: P$1 0.95,0; P$2 -0.95,0
ANT-2.4GHZ-6.5X2.2MM = smd 1.016 x 2.54: FEED -3.302,0; NC 3.302,0
FPC_12P_1MM = smd 0.5 x 1.5: 1 -5.5,2.297; 2 -4.5,2.297; 3 -3.5,2.297; 4 -2.5,2.297; 5 -1.5,2.297; 6 -0.5,2.297; 7 0.5,2.297; 8 1.5,2.297; 9 2.5,2.297; 10 3.5,2.297; 11 4.5,2.297; 12 5.5,2.297
CRYSTAL-SMD-3.2X1.5MM = smd 1 x 1.8: P$1 -1.25,0; P$2 1.25,0
SPARKFUN-RESISTORS_0603-RES = smd 0.94 x 1.016: 1 -0.85,0; 2 0.85,0

### Placement (x,y rotation side)
C1  10.83,19.81 0 top
C2  10.83,18.59 0 top
C3  91.14,35.2 270 top
C5  18.9,0.76 180 top
C6  37.03,7.16 0 top
C7  32.61,7.16 0 top
C8  28.96,14.94 0 top
C9  37.03,5.03 0 top
C10  37.03,11.73 0 top
C11  15.85,8.23 180 top
C12  15.85,7.01 0 top
C13  16.76,14.48 180 top
C14  64,11.43 0 top
C15  57.03,13.56 180 top
C16  -10.67,-24.69 0 top  (outside the outline)
C17  32.61,4.57 180 top
C18  -10.67,-23.16 0 top  (outside the outline)
C19  37.03,10.52 0 top
C20  37.03,9.3 0 top
C22  32.61,6.1 180 top
C25  88.7,35.2 90 top
C26  11.58,11.28 0 top
C27  11.58,12.5 0 top
C28  90.37,18.29 180 top
C29  90.37,15.85 0 top
C30  8.08,30.63 180 top
C31  8.08,33.07 0 top
C32  8.53,10.06 0 top
C33  14.33,3.2 0 top
C34  89.92,35.2 90 top
C35  37.03,14.17 180 top
C36  37.03,12.95 0 top
C38  28.96,13.87 180 top
D1  -12.5,-14.63 0 top  (outside the outline)
D4  -12.5,-33.68 0 top  (outside the outline)
F1  7.16,15.24 0 top
J1  72.77,6.6 270 top
J2  87.13,40.49 90 bottom
JP1  26.97,7.47 180 bottom
JP2  12.5,3.51 180 bottom
MODULE1  15.75,17 0 top
MODULE2  33.25,17 0 top
MODULE3  50.75,17 0 top
MODULE4  68.25,17 0 top
R1  8.53,11.28 180 top
R2  61.25,13.72 180 top
R3  32.61,3.51 180 top
R4  61.25,12.5 180 top
R5  -10.67,-30.94 0 top  (outside the outline)
R7  85.19,35.2 90 top
R8  86.11,5.64 180 top
R9  14.63,11.58 180 top
R10  14.63,12.8 0 top
R11  86.11,4.42 180 top
R12  86.11,3.2 180 top
R13  84.12,35.2 90 top
R14  61.26,10.36 0 top
R15  8.08,31.85 180 top
R16  8.08,29.41 180 top
R17  86.11,6.86 180 top
R18  86.26,35.2 90 top
R19  37.03,3.81 180 top
R20  87.48,35.2 90 top
R21  14.33,0.76 0 top
R22  14.33,1.98 0 top
R23  16.76,13.26 0 top
R24  86.11,1.98 180 top
R25  64.01,7.47 0 top
R26  64.01,6.25 0 top
R27  14.33,4.42 0 top
R28  -10.67,-16.61 0 top  (outside the outline)
R29  -10.67,-21.64 0 top  (outside the outline)
S1  92.2,11.02 0 top
S2  92.2,25.5 0 top
S3  92.2,39.98 0 top
S4  3.8,39.98 0 top
S5  3.8,25.5 180 top
S6  3.8,11.02 0 top
S7  85.65,49.99 0 top
T1  -12.5,-28.8 0 top  (outside the outline)
TP3  90.74,30.25 0 top
TP4  1.68,31.7 0 top
TP5  6.4,8.23 0 bottom
TP6  5.03,7.77 0 bottom
TP7  15.24,10.16 0 bottom
U1  24.08,7.62 225 top
U2  10.21,2.29 90 top
U3  -11.89,-19.2 0 top  (outside the outline)
U4  11.13,15.39 180 top
U$1  1.01,18.39 270 top
U$2  0,-3 0 top
U$3  48,25.5 0 top
U$4  80.26,11.6 270 bottom
U$5  10.36,41.45 90 bottom
U$6  [PAX-LOGO-0.25IN]  48.62,20.42 0 top
U$7  90.53,12.95 270 bottom
U$8  8.99,13.26 270 bottom
U$9  33.83,10.06 90 top
U$10  94.18,23.01 90 bottom
X2  48,11 0 top
Y3  34.9,6.1 270 top
Z1  7.16,19.05 180 top
Z2  7.16,20.88 180 top
Z3  7.16,17.22 180 top

### Tracks (layer width: path | path; a pad name or v marks a point on that pad's centre or on a via)
3.3V  (via drill 0.2)  (3 unrouted)
  Top 0.152: U1.13 27.45,14.17 v27.5,14.17 27.8,13.87 C38.2 C8.1 | 46.5,12.06 X2.5 46.5,14.77 v46.48,14.78 | C15.2 56,13.56 | 56,13.56 53.49,13.56 53.58,13.47 53.58,13.22 X2.12 | 46.5,12.06 46.44,12 v46.46,12 46.5,12 46.5,12.06 | v16.92,1.37 16,1.37 15.39,1.98 R22.2 | C13.1 17.68,14.48 17.98,14.17 v17.98,14.02 17.83,13.87 15.7,13.87 15.7,13.26 R23.1 | U1.19 21.49,14.1 v21.49,14.48 | C7.1 C22.2 31.7,5.94 31.24,6.4 v31.24,6.71 30.78,6.24 U1.64 | C14.2 v65.99,11.43 | v71.78,11.43 71.78,13.99 J1.4 | S4.1 1.26,42.93 v1.22,42.98 | C31.2 v10.62,33.07 | C32.2 10.06,10.06 v10.06,8.84 | v61.46,14.78 61.56,14.63 61.71,14.48 61.71,13.76 | 61.71,13.76 R2.1 | 61.71,13.76 61.71,13.72 61.86,13.56 61.86,12.5 R4.1 61.87,12.5 61.87,11.73 60.2,11.73 60.2,10.36 R14.1 | v56,14.78 56,13.59 56,13.56 | C34.2 v89.92,36.42 | C10.2 38.1,11.73 38.1,12.34 v41.6,12.34 | R13.1 84.12,33.83 v84.58,33.83 85.19,33.83 R7.1 | C30.1 9.45,30.63 v9.45,30.02 | S5.1 6.34,23.62 v4.88,23.62 | S6.3 1.26,8.73 v0.76,8.23 | R27.2 15.24,4.42 v15.54,4.12 | R12.1 R11.1 R8.1 R17.1 86.61,8.49 85.34,9.75 85.34,10.67 | R26.1 R25.1 63.51,6.86 v62.53,6.86
  Top 0.305: MODULE1.P$1 15.75,16 v14.75,16 | MODULE1.P$13 27.75,16 v28.9,16 | MODULE2.P$1 33.25,16 v32.1,16 | MODULE2.P$13 45.25,16 v46.71,16 | MODULE3.P$1 50.75,16 v49.45,16 | MODULE3.P$13 62.75,16 v63.9,16 | MODULE4.P$1 68.25,16 v67.1,16 | MODULE4.P$13 80.25,16 v81.25,16 | v24.02,1.35 23.99,1.37 23.16,1.37 22.96,1.2 U1.48 22.22,0.46 20.73,0.46 20.42,0.76 C5.1 | U1.32 17.98,8.41 17.98,8.08 17.91,8 v17.25,8 17.02,8.23 C11.1
  Top 0.406: C27.2 12.04,12.72 12.07,12.72 | 12.04,11.28 C26.2 | C27.2 12.08,12.72 12.07,12.72 | C27.2 C26.2 | v12.04,9.91 12.08,9.91 C26.2 | 12.07,12.72 U4.5
  Top 0.61: 85.5,10.67 85.34,10.67 v83.67,10.67
  Bottom 0.152: v41.6,12.34 46.48,12.34 46.52,12 v46.46,12 | v17.98,14.02 18.44,14.48 v21.49,14.48 | v65.99,11.43 v71.78,11.43 | J2.1 84.73,36.98 v84.73,37.03 | U$7.VCC 90.51,17.22 v91.44,17.22
  pour 3.3V: 96,53.74 96,0 -0.46,-0.3 0,53.74 12.9,53.74 12.9,18 83.1,18 83.1,53.74
!LCD_BL  (via drill 0.2)  (1 unrouted)
  Top 0.152: U1.43 21.43,3.2 21.79,3.2 21.95,3.05 24.23,3.05 24.99,3.81 v24.99,4.27 | v35.51,3.81 R19.2
  Bottom 0.152: v24.99,4.27 26.06,5.33 28.19,5.33 30.02,3.5 35.36,3.5 v35.51,3.81
BATT_STAT  (via drill 0.2)
  Top 0.152: R22.1 13.87,2.09 13.87,2.59 15.54,2.59 v16,2.13 | U1.37 17.98,4 v17.98,3.96
  Top 0.406: R22.1 13.26,1.98 12.65,1.37 11.55,1.37 U2.1
  Bottom 0.152: v17.98,3.96 18,3.96 16.15,2.13 v16,2.13
GND  (via drill 0.2)  (7 unrouted)
  Top 0.152: C38.1 29.46,13.3 29.41,13.26 27.89,13.26 27.58,13.56
  Top 0.305: U1.47 23.01,1.96 23.01,1.98 v23.47,1.98
  other vias: 64.15,12.19 47.26,14.94 55.33,12.8 81.01,5.94 40.26,5.69 30.68,7.38 25.14,5.98 12.57,2.33 7.19,1.14 14.02,13.72 11.19,21.36 10.15,28.7 11.04,31.57 30.51,15.59 59.27,12.04 64.76,15.39 69.63,11.89 90.82,36.73 34.18,12.56 90.45,10.05 92.8,35.66 33.83,3.96 94.87,7.46 86.04,18.58 90.76,6.85 23.47,12.99 4.11,13.65 11.43,9.54 87.47,40.08 87.16,44.2 3.2,14.94 2.5,21.21 3.87,27.61 3.72,32.95 8.99,8.78 16.07,2.94 19.05,2.9 17.37,2.13 16.92,4.88 6.55,6.71 11.89,7.77 14.33,7.77 16,9.45 83.29,9.44 82.38,3.34 62.78,3.81 57.29,4.72
  pour GND: 96,53.74 96,0 -0.46,-0.3 0,53.74 12.9,53.74 12.9,18 83.1,18 83.1,53.74
  pour Bottom: 0,53.74 12.9,53.74 12.9,18 83.1,18 83.1,53.74 96,53.74 96,0 -0.3,-0.46
  pour Top: 96,53.74 83.1,53.74 83.1,18 12.9,18 12.9,53.74 0,53.74 -0.3,-0.46 96,0
I2C1_SCL  (via drill 0.2)  (1 unrouted)
  Top 0.152: 60.66,12.5 R4.2 60.64,12.39 60.64,12.48 60.66,12.5 | 59.89,12.5 59.58,12.5 v59.58,16 | U1.61 30.33,4.55 30.33,3.66 31.38,2.59 59.89,2.59 59.89,12.5 | 59.89,12.5 60.66,12.5
  3.3V 0.152: v75.4,16.31 75.4,16.46 71.59,16.46 70.53,15.39 68.39,15.39 67.33,16.46 63.69,16.46 62.62,15.39 60.19,15.39 v59.58,16 59.12,16.46 53.63,16.46 52.41,15.24 50.89,15.24 49.67,16.46 46.49,16.46 45.27,15.24 42.84,15.24 v42.07,16 41.62,16.46 36.13,16.46 35.06,15.39 33.39,15.39 32.32,16.46 28.69,16.46 27.62,15.39 25.03,15.39 v24.57,15.85
  Bottom 0.152: MODULE4.P$10 75.86,16.75 v75.4,16.31 | MODULE3.P$10 58.75,16 v59.58,16 | v24.57,15.85 23.75,15.85 MODULE1.P$10 | MODULE2.P$10 41.25,16 v42.07,16
I2C1_SDA  (via drill 0.2)  (1 unrouted)
  Top 0.152: R2.2 v60.03,13.72 60.03,16.46 v59.88,16.61 | U1.62 30.63,4.96 30.63,3.81 31.55,2.9 59.58,2.9 59.58,11.28 v59.42,11.43
  3.3V 0.152: v77.38,16.31 76.93,16.76 71.44,16.76 70.37,15.7 68.54,15.7 67.48,16.76 63.54,16.76 62.47,15.7 60.95,15.7 59.88,16.76 | 42.38,16.76 35.98,16.76 34.91,15.7 33.54,15.7 32.47,16.76 28.54,16.76 27.47,15.7 25.64,15.7 v24.88,16.46 | v42.38,16.61 42.38,16.76 | 42.38,16.76 43.6,15.54 45.12,15.54 46.34,16.76 49.82,16.76 51.04,15.54 52.26,15.54 53.48,16.76 59.88,16.76 | 59.88,16.76 v59.88,16.61
  Bottom 0.152: MODULE4.P$12 77.84,16.75 v77.38,16.31 | v59.88,16.61 60.75,16.61 MODULE3.P$12 | MODULE2.P$12 42.38,16.75 v42.38,16.61 | v24.88,16.46 24.88,16.76 25.74,16.76 MODULE1.P$12 | v59.42,11.43 59.44,11.43 59.74,11.73 59.74,13.41 v60.03,13.72
LCD_A0  (via drill 0.2)
  Top 0.152: X2.8 49.53,13.3 v49.53,8.08 | U1.2 29.13,8.08 v29.11,8.08
  Bottom 0.152: v29.11,8.08 29.26,8.23 49.53,8.23 v49.53,8.08
LCD_CS  (via drill 0.2)
  Top 0.152: X2.10 51.51,13.3 v51.51,3.81 | U1.50 25.15,1.96 25.15,2.44 v26.21,3.5
  Bottom 0.152: v51.51,3.81 51.51,2.29 26.67,2.29 26.21,2.74 v26.21,3.5
LCD_MOSI  (via drill 0.2)
  Top 0.152: X2.6 47.55,13.3 v47.55,4.88 | U1.57 27.43,4.62 v27.43,4.88
  Bottom 0.152: v47.55,4.88 47.55,3.2 28.5,3.2 27.43,4.27 v27.43,4.88
LCD_RST  (via drill 0.2)
  Top 0.152: X2.9 50.44,13.3 v50.44,4.57 | U1.56 27.43,3.91 27.43,4.12 v26.82,4.72
  Bottom 0.152: v50.44,4.57 50.44,4.27 48.01,4.27 48.01,2.9 28.35,2.9 27.13,4.12 27.13,4.42 v26.82,4.72
LCD_SCK  (via drill 0.2)
  Top 0.152: X2.7 48.46,13.3 v48.46,3.81 | U1.55 27.05,3.59 27.05,3.73 v26.67,4.12
  Bottom 0.152: v48.46,3.81 48.46,2.59 28.19,2.59 v26.67,4.12
MOD1_GPIO1
  Top 0.152: MODULE1.P$9 23.81,16.69 23.81,15.54 23.35,15.09 21.34,15.09 21.03,14.78 21.03,13.85 U1.20
MOD1_GPIO2
  Top 0.152: MODULE1.P$11 25.75,15.5 26.5,14.75 26.5,14.64 U1.15
MOD2_GPIO1  (via drill 0.2)
  Top 0.152: U1.26 20.27,10.36 v20.57,10.36 | 32.16,12.5 v32.17,12.5 33.38,12.5 33.38,14.02 35.05,14.02 35.05,14.78 36.88,14.78 36.88,15.09 41.3,15.09 41.31,16.69 MODULE2.P$9
  Bottom 0.152: v20.57,10.36 21.03,10.82 24.69,10.82 26.67,12.8 30.8,12.8 31.1,12.5 v32.17,12.5
MOD2_GPIO2  (via drill 0.2)
  Top 0.152: U1.11 27.64,12.95 29.87,12.95 30.33,12.5 v30.33,12.34 | MODULE2.P$11 43.29,16.15 43.29,15.64 43.68,15.25 44.59,15.25 45,14.84 v45,11.48
  Bottom 0.152: v30.33,12.34 31.39,11.28 44.81,11.28 44.93,11.4 v45,11.48
MOD3_GPIO1  (via drill 0.2)
  Top 0.152: U1.33 18.17,7.01 v19.51,7.01 | v58.97,9.3 58.67,9.6 58.67,16 58.75,16.07 MODULE3.P$9
  Bottom 0.152: v19.51,7.01 20.88,7.01 23.32,9.45 58.97,9.45 v58.97,9.3
MOD3_GPIO2  (via drill 0.2)
  Top 0.152: U1.10 28.05,12.65 29.41,12.65 v29.72,12.34 | v62.02,11.28 62.03,11.28 62.33,11.58 62.33,15.24 60.75,15.24 MODULE3.P$11
  Bottom 0.152: v29.72,12.34 29.72,12.19 30.94,10.97 61.57,10.97 61.86,11.27 v62.02,11.28
MOD4_GPIO1  (via drill 0.2)
  Top 0.152: v73,11.43 75.59,11.43 75.89,11.73 75.89,15.39 76.25,15.39 MODULE4.P$9 | U1.27 20.18,9.75 v20.73,9.75
  Bottom 0.152: v73,11.43 73,10.67 28.8,10.67 26.98,12.5 26.82,12.5 24.84,10.52 21.49,10.52 v20.73,9.75
MOD4_GPIO2  (via drill 0.2)
  Top 0.152: v76.16,11.12 76.66,11.62 76.66,14.94 78.18,14.94 78.18,16.15 78.25,16.22 MODULE4.P$11 | U1.8 27.48,10.67 v27.28,10.67
  Bottom 0.152: v27.28,10.67 28.04,10.67 28.35,10.36 73.3,10.36 73.3,10.97 73.46,11.12 v76.16,11.12
N$4
  Top 0.152: X2.11 52.5,3.2 38.25,3.2 38.25,3.81 R19.1
N$5  (via drill 0.2)
  Top 0.152: v12.95,4.57 12.95,4.42 R27.1
  Bottom 0.152: JP2.2 12.5,4.57 v12.95,4.57
N$10
  3.3V 1: 0.7,14.9 1.3,14.9
N$12
  3.3V 1: 3.7,15.7 3.7,16.1
N$13
  Bottom 0.813: U$10.FEED 94.13,19.66 88.7,19.66 88.7,17.32 U$7.ANT
N$14
  3.3V 1: 0.7,21.9 1.3,21.9
N$16  (2 unrouted)
N$25  (1 unrouted)
N$26  (3 unrouted)
N$37
  Top 0.152: C35.1 38.1,14.17 38.1,14.78 44.5,14.78 X2.3
N$38
  Top 0.152: C35.2 35.97,14.17 35.97,13.56 41.91,13.56 41.91,14.33 43.43,14.33 43.5,14.26 X2.2
N$39
  Top 0.152: C36.2 42.52,12.95 42.52,12.8 42.5,12.82 X2.1
N$70
  Top 0.406: U2.5 8.91,0.69 8.99,0.61 12.5,0.61 12.65,0.76 R21.1
NRST  (via drill 0.2)
  Top 0.152: U1.7 27.88,10.36 v27.74,10.21 | S7.4 87.42,48.77 87.48,48.77 87.48,48.16 87.63,48.01 v87.63,42.52 | C3.1 91.14,36.27 v92.05,36.27 | v77.72,8.99 73.91,8.99 v73.76,8.84 73.76,6.86 81.23,6.86 82.45,8.08 83.67,8.08 84.89,6.86 R17.2
  Bottom 0.152: v27.74,10.21 27.89,10.06 73.3,10.06 73.3,8.84 v73.76,8.84 | v87.63,42.52 87.78,42.52 87.78,42.98 89,42.98 89,43.03 J2.10 90.07,43.03 90.07,42.98 92.05,42.98 92.05,37.34 | 92.05,37.34 87.02,37.34 87.02,22.55 85.8,22.55 84.12,20.88 84.12,13.11 77.57,13.11 77.57,9.14 v77.72,8.99 | v92.05,36.27 92.05,37.34
OSC_IN
  Top 0.152: U1.5 29.91,10.97 31.39,10.97 32.16,10.21 32.16,9.41 32.95,9.41 U$9.P$2 34.02,9.3 34.14,9.3 34.9,8.84 34.9,9.3 C20.1
OSC_OUT
  Top 0.152: U1.6 29.5,11.28 33.65,11.28 U$9.P$1 34.17,10.97 34.17,10.55 35.05,10.52 C19.1
PC1_BOOT0  (via drill 0.2)
  Top 0.152: U1.60 27.77,6.4 v27.58,6.4 27.58,7.77 25.76,9.6 25.76,10.06 26.82,11.12 27.23,11.12 U1.9 | R3.2 31.7,3.5 31.09,4.12 v31.09,4.57 C17.2
  Bottom 0.152: JP1.2 27.43,6.56 v27.58,6.4 29.41,4.57 v31.09,4.57
PULLBACK_1
  3.3V 1: 3.7,20.7 3.7,21.1
RTC_BAT  (via drill 0.2)
  Top 0.152: U1.1 30.61,8.82 29.26,7.47 28.65,7.47 26.36,9.75 v26.36,9.91 | v11.12,4.57 11.73,4.57 12.19,5.03 13.41,5.03 v14.17,5.79
  Bottom 0.152: U$8.P$3 9.27,5.79 10.49,4.57 v11.12,4.57 | v26.36,9.91 26.21,9.75 23.16,9.75 20.88,7.47 15.85,7.47 v14.17,5.79
RTC_OSC_IN
  Top 0.152: U1.3 30.56,10.21 30.94,10.21 31.55,9.6 31.55,7.77 33.68,7.77 33.68,6.4 35.05,5.03 | 35.05,5.03 Y3.P$2 | 35.05,5.03 C9.1
RTC_OSC_OUT
  Top 0.152: U1.4 30.31,10.67 30.94,10.67 31.85,9.75 31.85,8.08 34.9,8.08 Y3.P$1 35.23,7.16 C6.1
SDIO_CK
  Top 0.152: U1.53 27.85,1.37 71.02,1.37 71.02,13.56 70.78,13.56 J1.5
SDIO_CMD  (via drill 0.2)
  Top 0.152: U1.54 28.25,1.68 70.71,1.68 70.71,6.25 | 70.71,6.25 70.71,12.19 v70.56,12.19 | v72.39,12.19 73,12.19 73,13.41 72.85,13.56 72.85,13.96 J1.3 | R26.2 70.71,6.25
  Bottom 0.152: v70.56,12.19 v72.39,12.19
SDIO_D0  (via drill 0.2)
  Top 0.152: U1.39 20.27,4.88 23.16,4.88 23.32,5.03 v24.23,5.03 | v68.89,7.01 68.89,7.47 | 68.89,7.47 68.89,12.8 68.73,12.95 68.73,13.94 J1.7 | R25.2 68.89,7.47
  Bottom 0.152: v24.23,5.03 24.23,4.27 26.52,1.98 68.89,1.98 v68.89,7.01
SPI1_MISO  (via drill 0.2)
  Top 0.152: 19.7,16.7 MODULE1.P$5 19.75,16.22 19.81,16.15 19.81,15.54 20.27,15.09 20.27,13.2 U1.22 21.73,11.73 v22.71,11.73 | v32.17,13.26 32.31,13.41 32.31,14.63 34.44,14.63 34.44,15.39 36.27,15.39 36.27,16 37.2,16 37.2,16.15 37.25,16.21 MODULE2.P$5
  Bottom 0.152: v22.71,11.73 22.86,11.58 24.54,11.58 26.36,13.41 32.02,13.41 v32.17,13.26
SPI1_MOSI  (via drill 0.2)
  Top 0.152: 19.58,13.18 U1.23 21.48,11.28 v21.95,11.28 | 19.58,13.18 17.75,15.01 17.75,16 17.87,16.15 17.75,16.27 MODULE1.P$3 | v31.55,12.95 31.55,15.24 34.14,15.24 34.14,16.15 35.06,16.15 35.25,16.27 MODULE2.P$3 | R23.2 17.34,13.18 19.58,13.18
  Bottom 0.152: v21.95,11.28 24.69,11.28 26.52,13.11 31.55,13.11 v31.55,12.95
SPI1_SCK  (via drill 0.2)
  Top 0.152: v23.32,12.19 21.98,12.19 U1.21 20.73,13.45 20.73,14.94 21.18,15.39 21.64,15.39 21.75,15.5 MODULE1.P$7 | v32.78,13.41 32.77,13.41 32.77,14.33 34.75,14.33 34.75,15.09 36.58,15.09 36.58,15.39 39.18,15.39 39.18,16.15 39.25,16.23 MODULE2.P$7
  Bottom 0.152: v23.32,12.19 23.62,11.89 24.38,11.89 26.21,13.72 32.47,13.72 v32.78,13.41
SPI2_MISO  (via drill 0.2)
  Top 0.152: U1.35 18.67,6.1 v20.42,6.1 | v53.1,8.38 53.1,8.35 53,8.51 53,14.4 54.75,14.4 MODULE3.P$5 | MODULE4.P$5 72.2,16.75 72.2,15.09 65.84,15.09 65.38,14.63 63.4,14.63 62.94,14.17 v62.94,8.38
  Bottom 0.152: v20.42,6.1 20.73,6.4 21.18,6.4 23.62,8.84 53.1,8.84 v53.1,8.38 v62.94,8.38
SPI2_MOSI  (via drill 0.2)
  Top 0.152: U1.36 18.92,5.64 v20.88,5.64 | v51.97,7.92 52,7.96 52,14.5 52.75,15.25 MODULE3.P$3 | MODULE4.P$3 70.25,16.18 70.22,16.15 70.22,15.39 65.68,15.39 65.23,14.94 63.25,14.94 62.64,14.33 62.64,10.36 | 62.64,10.36 62.64,8.84 62.32,8.53 v62.32,7.92 | R14.2 62.64,10.36
  Bottom 0.152: v20.88,5.64 23.77,8.53 51.97,8.53 v51.97,7.92 v62.32,7.92
SPI2_SCK  (via drill 0.2)
  Top 0.152: U1.34 18.42,6.55 v19.96,6.55 | v58.37,8.84 58.36,15.09 58.05,15.39 56.83,15.39 56.83,16 MODULE3.P$7 | MODULE4.P$7 74.33,16.75 v74.33,15.24 | v66.75,12.8 v66.75,8.84
  Bottom 0.152: v19.96,6.55 20.12,6.71 21.03,6.71 23.47,9.14 58.37,9.14 v58.37,8.84 v66.75,8.84 | 74.37,15.24 v74.33,15.24 73.15,15.24 73.15,13.72 66.75,13.72 v66.75,12.8
SW_A  (via drill 0.2)
  Top 0.152: R8.2 v84.43,5.64 | U1.38 19.87,5.18 22.1,5.18 v22.25,5.33 | C25.2 v88.7,36.58 88.7,37.11 S3.3
  Bottom 0.152: v22.25,5.33 26.21,1.37 83.67,1.37 83.67,5.64 v84.43,5.64 84.43,20.73 85.95,22.25 87.33,22.25 87.33,36.58 v88.7,36.58
SW_B  (via drill 0.2)
  Top 0.152: U1.41 20.77,3.96 v22.86,3.96 | C28.2 88.54,18.29 | 88.54,18.29 88.54,19.66 88.85,19.96 88.85,22.71 89.61,23.47 89.76,23.47 89.76,23.59 S2.3 | R11.2 v84.12,4.42 | v88.54,4.42 88.54,18.29
  Bottom 0.152: v22.86,3.96 23.16,3.96 26.06,1.07 84.12,1.07 v84.12,4.42 v88.54,4.42
SW_C  (via drill 0.2)
  Top 0.152: U1.42 21.18,3.66 21.79,3.66 21.95,3.5 v22.4,3.5 | R12.2 v84.73,3.2 | v88.54,3.2 89,3.66 89,8.99 89.15,8.99 89,9.14 89.63,9.14 S1.3 89.68,9.14 91.59,9.14 91.59,15.85 C29.2
  Bottom 0.152: v22.4,3.5 23.16,3.5 25.91,0.76 84.73,0.76 v84.73,3.2 v88.54,3.2
SW_D_BOOT0  (via drill 0.2)
  Top 0.152: v23.77,7.47 21.05,7.47 U1.29 17.85,10.67 v17.68,10.82 | S4.3 1.26,37.19 7.01,37.19 7.01,33.07 | 7.01,33.07 7.01,31.85 | 7.01,33.07 C31.1 | R15.2 7.01,31.85 | 7.01,31.85 v6.1,31.85
  Bottom 0.152: v23.77,7.47 JP1.1 | v17.68,10.82 17.68,11.28 10.52,18.44 6.55,18.44 6.55,31.85 v6.1,31.85
SW_E_BOOT1  (via drill 0.2)
  Top 0.152: 7.01,29.41 6.34,29.41 S5.3 6.34,27.28 5.79,27.28 v5.79,24.38 | 7.01,29.41 7.01,30.63 C30.2 | 7.01,29.41 R16.2 7.62,29.37 | U1.28 17.95,11.28 17.22,11.28 v17.07,11.12
  Bottom 0.152: v17.07,11.12 17.07,11.43 10.36,18.14 6.25,18.14 6.25,24.38 v5.79,24.38
SW_PWR  (via drill 0.2)
  Top 0.152: S6.1 1.26,10.67 7.92,10.67 | 7.92,10.67 7.92,11.12 R1.2 | C32.1 7.92,10.06 | 7.92,10.06 7.92,10.67 | 7.92,10.06 7.92,8.84 8.53,8.23 10.82,8.23 11.12,8.53 12.95,8.53 v12.95,8.84 | U1.14 25.52,12.95 24.84,12.95 20.88,8.99 v20.88,8.53
  Bottom 0.152: v20.88,8.53 13.41,8.53 13.11,8.84 v12.95,8.84
SWCLK  (via drill 0.2)
  Top 0.152: U1.49 25.94,0.46 88.54,0.46 v88.54,1.37 | R18.1 86.26,33.38 v87.78,33.38
  Bottom 0.152: v88.54,1.37 89,1.83 89,6.86 87.94,6.86 84.73,6.86 84.73,20.57 86.11,21.95 87.63,21.95 87.63,33.38 v87.78,33.38
SWDCLK_M  (via drill 0.2)
  Top 0.152: v86.26,38.1 R18.2
  Bottom 0.152: J2.4 86.26,39.22 86.26,38.56 v86.26,38.1
SWDIO  (via drill 0.2)
  Top 0.152: U1.46 22.94,2.59 v23.16,2.59 | v88.54,33.98 87.48,33.98 R20.1
  Bottom 0.152: v23.16,2.59 23.62,2.59 25.76,0.46 89.31,0.46 89.31,7.16 85.04,7.16 85.04,20.42 86.26,21.64 87.94,21.64 87.94,32.77 88.54,32.77 v88.54,33.98
SWDIO_M  (via drill 0.2)
  Top 0.152: v87.48,37.95 R20.2
  Bottom 0.152: J2.2 v87.48,37.95
USART1_RX  (via drill 0.2)
  Top 0.152: v69.65,2.74 69.19,2.29 31.18,2.29 U1.59 28.35,5.12 28.35,5.33 27.74,5.94 26.67,5.94 23.32,9.3 22.25,9.3 v22.1,9.45 | R13.2 v84.12,36.58
  Bottom 0.152: v69.65,2.74 73.3,2.74 76.96,6.4 76.96,13.72 83.52,13.72 83.52,36.58 | J2.7 84.12,41.76 83.52,41.76 83.52,36.58 | v22.1,9.45 21.95,9.3 20.12,9.3 18.44,10.97 18.44,11.43 10.82,19.05 7.16,19.05 7.16,40.23 11.58,40.23 11.58,40.84 11.63,40.84 U$5.3 | v84.12,36.58 83.52,36.58
USART1_TX  (via drill 0.2)
  Top 0.152: v70.1,2.29 69.8,1.98 30.78,1.98 U1.58 28.04,4.72 28.04,5.18 27.58,5.64 26.52,5.64 23.16,8.99 21.64,8.99 v21.49,8.84 | R7.2 85.19,38.86 | 85.19,38.86 88.09,38.86 v88.09,41.76 | v83.97,22.4 83.52,22.4 83.52,38.86 85.19,38.86
  Bottom 0.152: v70.1,2.29 73.3,2.29 77.27,6.25 77.27,13.41 83.82,13.41 83.82,22.25 v83.97,22.4 | v88.09,41.76 89,41.76 J2.8 | v21.49,8.84 21.34,8.99 19.96,8.99 18.14,10.82 18.14,11.28 10.67,18.75 6.86,18.75 6.86,40.59 9.14,40.59 9.14,40.69 9.09,40.69 U$5.1
USART2_RX  (via drill 0.2)
  Top 0.152: v38.56,14.02 v39.47,14.02 | v24.84,14.48 v23.32,14.48 22.88,14.48 U1.17
  Bottom 0.152: MODULE1.P$4 17.87,16.75 17.83,16.76 17.9,16.7 17.9,15.09 22.71,15.09 v23.32,14.48 | 35.2,14.63 35.2,14.02 v38.56,14.02 | v39.47,14.02 39.47,13.87 52.88,13.87 52.88,15.39 | 52.88,15.39 52.88,16.61 52.87,16.63 arc90 MODULE3.P$4 | 52.88,15.39 53.95,15.39 54.41,14.94 54.41,14.33 59.28,14.33 59.59,14.63 60.5,14.63 60.81,14.33 70.25,14.33 MODULE4.P$4 | v24.84,14.48 26.06,14.48 26.52,14.94 28.19,14.94 28.65,14.63 35.2,14.63 | MODULE2.P$4 35.22,16.72 35.2,16.72 35.2,14.63
USART2_TX  (via drill 0.2)
  Top 0.152: U1.16 24.69,13.56 v24.23,13.56 | v53.8,15.85 53.65,15.85 53.65,15.09 v53.49,14.94
  Bottom 0.152: MODULE1.P$6 19.75,15.39 23.32,15.39 24.23,14.48 v24.23,13.56 25.6,13.56 26.67,14.63 28.04,14.63 28.65,14.02 32.92,14.02 33.53,13.41 39.01,13.41 | 39.01,13.41 53.49,13.41 53.49,14.02 | 53.49,14.02 59.42,14.02 59.73,14.33 60.34,14.33 60.64,14.02 72.29,14.02 MODULE4.P$6 | MODULE2.P$6 arc90 37.2,16.7 37.2,16.15 arc-90 37.05,16 36.27,16 36.27,14.63 39.01,14.63 39.01,13.41 | MODULE3.P$6 54.7,16.75 54.7,16.15 53.99,16.15 v53.8,15.85 | v53.49,14.94 53.49,14.02
USART3_RX  (via drill 0.2)
  Top 0.152: U1.52 27.45,1.07 87.78,1.07 87.78,8.23 87.02,8.99 87.02,12.95 v87.48,12.95
  Bottom 0.152: v87.48,12.95 86.72,12.95 86.71,12.96 U$7.TX
USART3_TX  (via drill 0.2)
  Top 0.152: U1.51 27.05,0.76 88.09,0.76 88.09,8.38 87.48,8.99 v87.48,11.12
  Bottom 0.152: v87.48,11.12 86.72,11.12 86.65,11.06 U$7.RX
USB_DM  (via drill 0.2)
  Top 0.152: U1.44 20.61,1.68 19.2,1.68 15.7,5.18 v15.7,5.49
  Top 0.305: U$1.PIN$2 4.88,19.04 4.88,20.88 v5.49,20.88 Z2.2
  Bottom 0.152: v15.7,5.49 15.7,5.03 11.58,5.03 | v5.49,20.88 4.57,20.88 4.57,19.81 2.13,19.81 2.13,12.19 4.12,12.19 4.12,8.23 5.03,8.23 TP6.P$1 | 5.18,7.77 TP6.P$1 | 11.58,5.03 11.12,5.03 11.12,7.47 5.94,7.47 5.64,7.77 TP6.P$1 | 11.58,5.03 11.58,3.96 11.48,3.91 JP2.1
USB_DP  (via drill 0.2)
  Top 0.152: U1.45 21.01,1.37 19.05,1.37 16.76,3.66 | v15.09,5.94 15.09,5.33 16.76,3.66 | v16.61,3.5 16.76,3.66 | v5.49,18.44 5.49,18.7 5.44,18.75
  Top 0.305: U$1.PIN$3 5.44,18.39 5.44,18.75 5.44,19.05 Z1.2
  Bottom 0.152: v15.09,5.94 15.09,5.33 11.43,5.33 11.43,7.77 6.86,7.77 TP5.P$1 6.4,8.53 4.42,8.53 4.42,12.5 2.44,12.5 2.44,19.51 4.88,19.51 4.88,18.44 v5.49,18.44 | 12.5,3.5 v16.61,3.5
USB_VCC
  Top 0.406: U$1.PIN$1 2.44,19.69 2.44,14.33 4.88,14.33 4.88,15.24 | 4.88,15.24 F1.1 5.94,15.24 | Z3.2 4.88,17.22 4.88,15.24
VBAT  (via drill 0.2)  (5 unrouted)
  Top 0.406: 10.21,3.2 11.47,3.2 11.47,3.24 U2.3 11.55,3.2 C33.1
  Top 0.61: v81.99,8.53 81.99,11.58 83.06,11.58 83.06,12.65 | v10.21,1.37 10.21,3.2
  3.3V 0.61: v78.94,4.72 78.94,0.61 10.21,0.61 v10.21,1.37
  Bottom 0.61: 80.49,8.53 v81.99,8.53 | 80.49,8.53 78.94,8.53 v78.94,4.72 | U$4.P$1 80.49,8.53
VBUS  (via drill 0.2)  (4 unrouted)
  Top 0.152: R10.1 13.56,12.8 13.56,16.76
  Top 0.406: U2.4 v6.71,3.24 | v81.84,17.37 81.84,16.15 83.06,16.15 83.1,16.15 85.39,16.15 | v13.99,16.76 13.56,16.76 12.23,16.76 | C1.2 C2.2 11.33,17.68 | 9.14,15.24 9.14,13.72 5.03,13.72 5.03,11.73 v3.35,11.73 | 9.14,15.24 F1.2 | 9.14,15.24 9.45,15.24 9.45,17.68 10.21,17.68 | 10.21,17.68 11.33,17.68 | 10.21,16.69 10.21,17.68 | 11.33,17.68 12.07,17.68
  Top 0.61: 83.05,16.15 83.06,16.15
  3.3V 0.406: v81.84,17.37 80.89,17.37 79.82,16.15 78.75,16.15 77.54,17.37 v75.1,17.37 71.29,17.37 70.07,16.15 68.85,16.15 67.63,17.37 63.39,17.37 62.17,16.15 61.25,16.15 60.03,17.37 v57.59,17.37 53.33,17.37 52.11,16.15 51.19,16.15 49.98,17.37 46.34,17.37 44.97,16 43.9,16 42.53,17.37 v40.09,17.37 35.98,17.37 34.76,16.15 33.84,16.15 32.63,17.37 28.38,17.37 27.32,16.15 26.25,16.15 25.03,17.37 24.57,17.37 23.96,16.76 v22.59,16.76 17.87,16.76 17.26,16.15 16.34,16.15 15.73,16.76 v13.99,16.76
  Bottom 0.406: v6.71,3.24 6.71,4.72 3.35,8.08 v3.35,11.73 | 21.83,16.76 v22.59,16.76 | 39.25,17.37 v40.09,17.37 | 56.75,17.37 v57.59,17.37 | 74.25,17.37 v75.1,17.37
  Bottom 0.61: MODULE1.P$8 21.75,17.37 21.83,16.76 | MODULE2.P$8 39.25,17.37 | MODULE3.P$8 56.75,17.37 | MODULE4.P$8 74.25,17.37
VBUS_DETECT
  Top 0.152: R10.2 15.7,12.8 15.7,12.5 | 15.7,12.5 15.7,11.58 R9.1 | U1.24 19.56,12.5 15.7,12.5
VCAP1  (via drill 0.2)
  Top 0.152: U1.30 17.3,10.52 v16.61,10.52
  Top 0.305: C12.2 16.76,7.01 17.22,7.47 18.14,7.47 18.75,8.08 18.75,9.06 U1.30
  Bottom 0.152: v16.61,10.52 15.54,10.52 TP7.P$1
WIFI_EN  (via drill 0.2)
  Top 0.152: v23.77,4.57 20.68,4.57 U1.40 | v72.08,1.83 72.08,1.37 87.48,1.37 87.48,1.98 | 87.48,1.98 R24.1 | 87.48,1.98 87.48,8.08 86.41,9.14 v86.41,15.85
  Bottom 0.152: v23.77,4.57 23.77,4.27 26.36,1.68 72.08,1.68 v72.08,1.83 | v86.41,15.85 92.35,15.85 92.35,16.76 92.37,17.81 U$7.CH_PD

### Text on the board
Top: LAYER: 1
GND: LAYER: 2
3.3V: LAYER: 3
Bottom: LAYER: 4
tPlace: RESET | SW_A | SW_D | GND | GND | SW_E | Pax Instruments | SW_B | LabWiz 0.4 | 3V3 | MISO | SCK | M1G1 | M1G2 | 3V3 | MISO | SCK | M2G1 | M2G2 | 3V3 | MISO | SCK | M3G1 | M3G2 | 3V3 | MISO | SCK | M4G1 | M4G2 | MOSI | MOSI | 3V3 | MOSI | 3V3 | MOSI | 3V3 | 3V3 | SPI1 | SPI2 | SPI2 | SW_C | ST | SW_PWR | STM32
bPlace: TX | RX | USART1 | GND | CORTEX | ESP8266 | GND | GND | GND | GND | USART3 RX | USART3 TX | VBUS | I2C1 SCL | I2C1 SDA | GND | GND | USART3 RX | USART3 TX | VBUS | I2C1 SCL | I2C1 SDA | GND | GND | USART3 RX | USART3 TX | VBUS | I2C1 SCL | I2C1 SDA | GND | GND | USART3 RX | USART3 TX | VBUS | I2C1 SCL | SDA | USB_DP | USB_DM | BOOT0 / to SW_E | USB FS/HS / / USB LS